# Altium project Double-Width Hub Bridge.PrjPcb
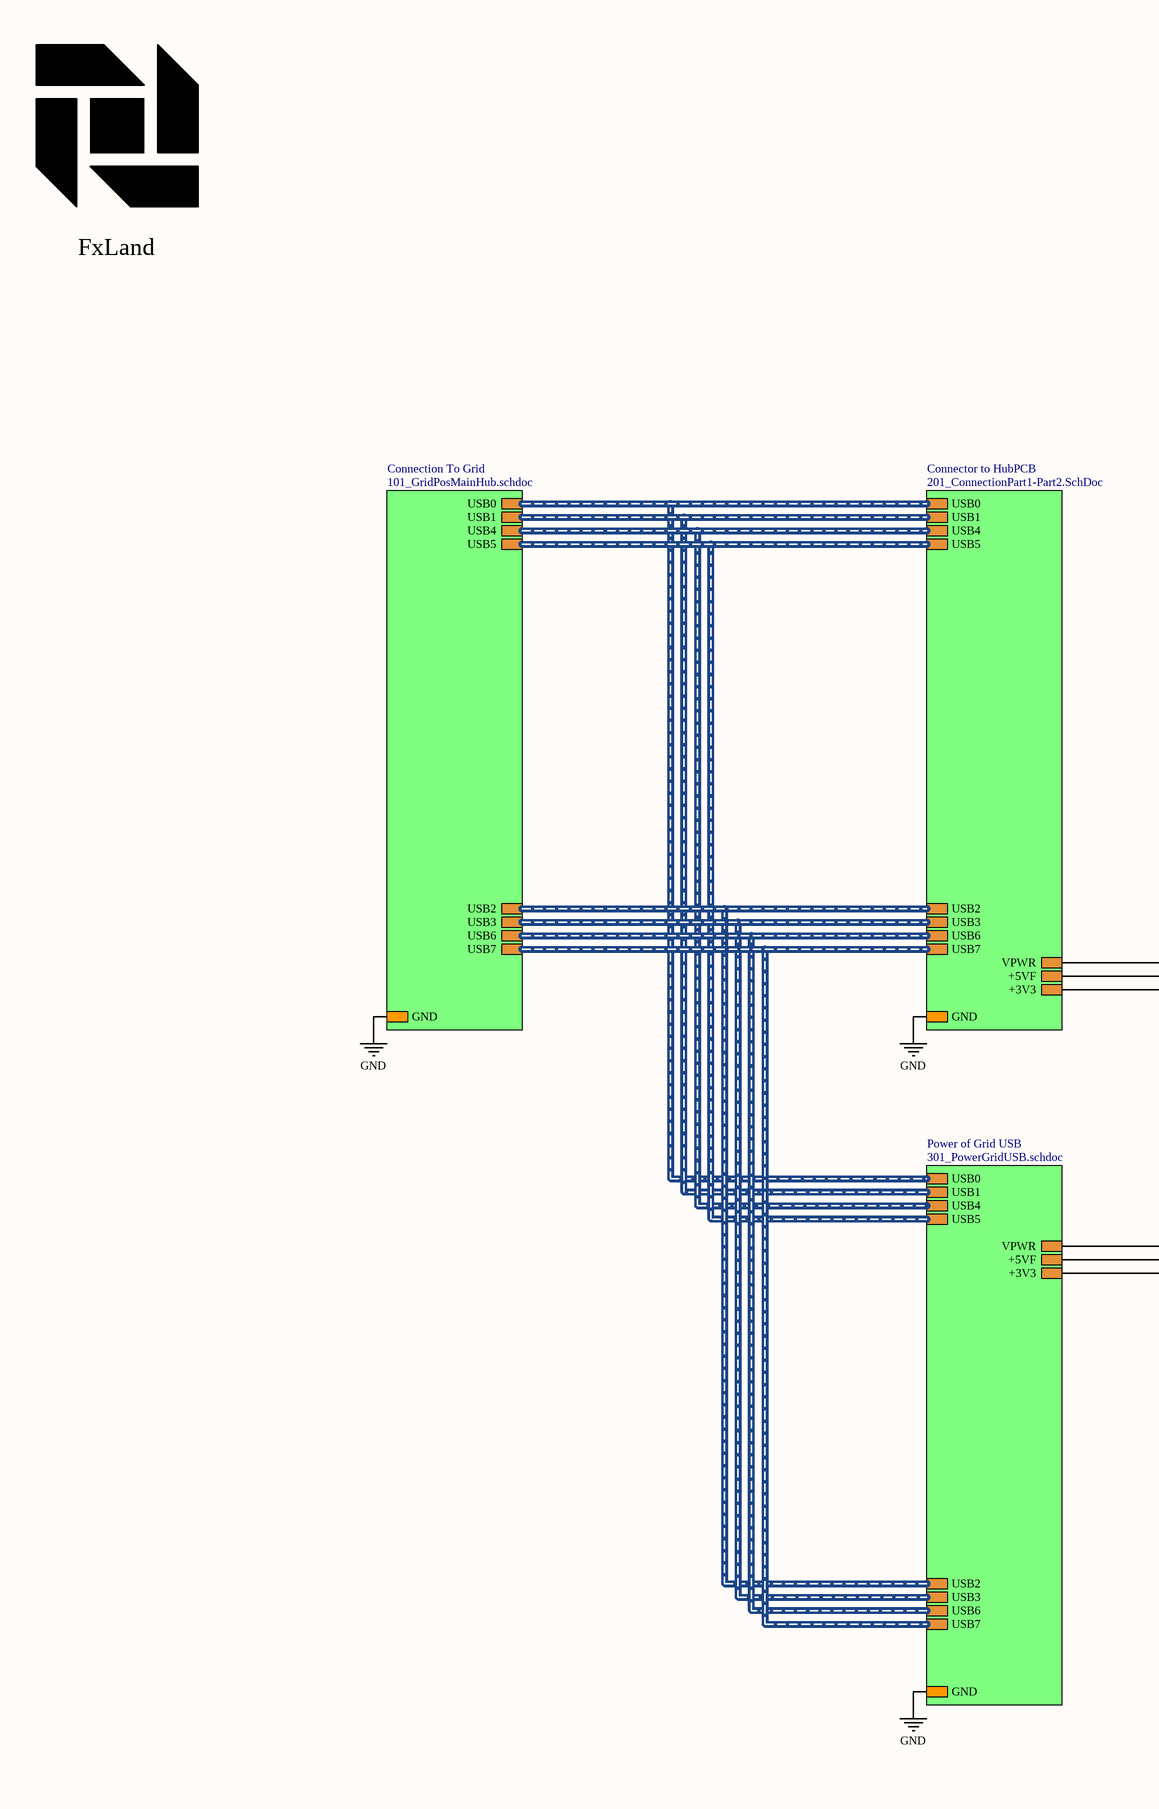
[diagram p0: 001_top.SchDoc, left]
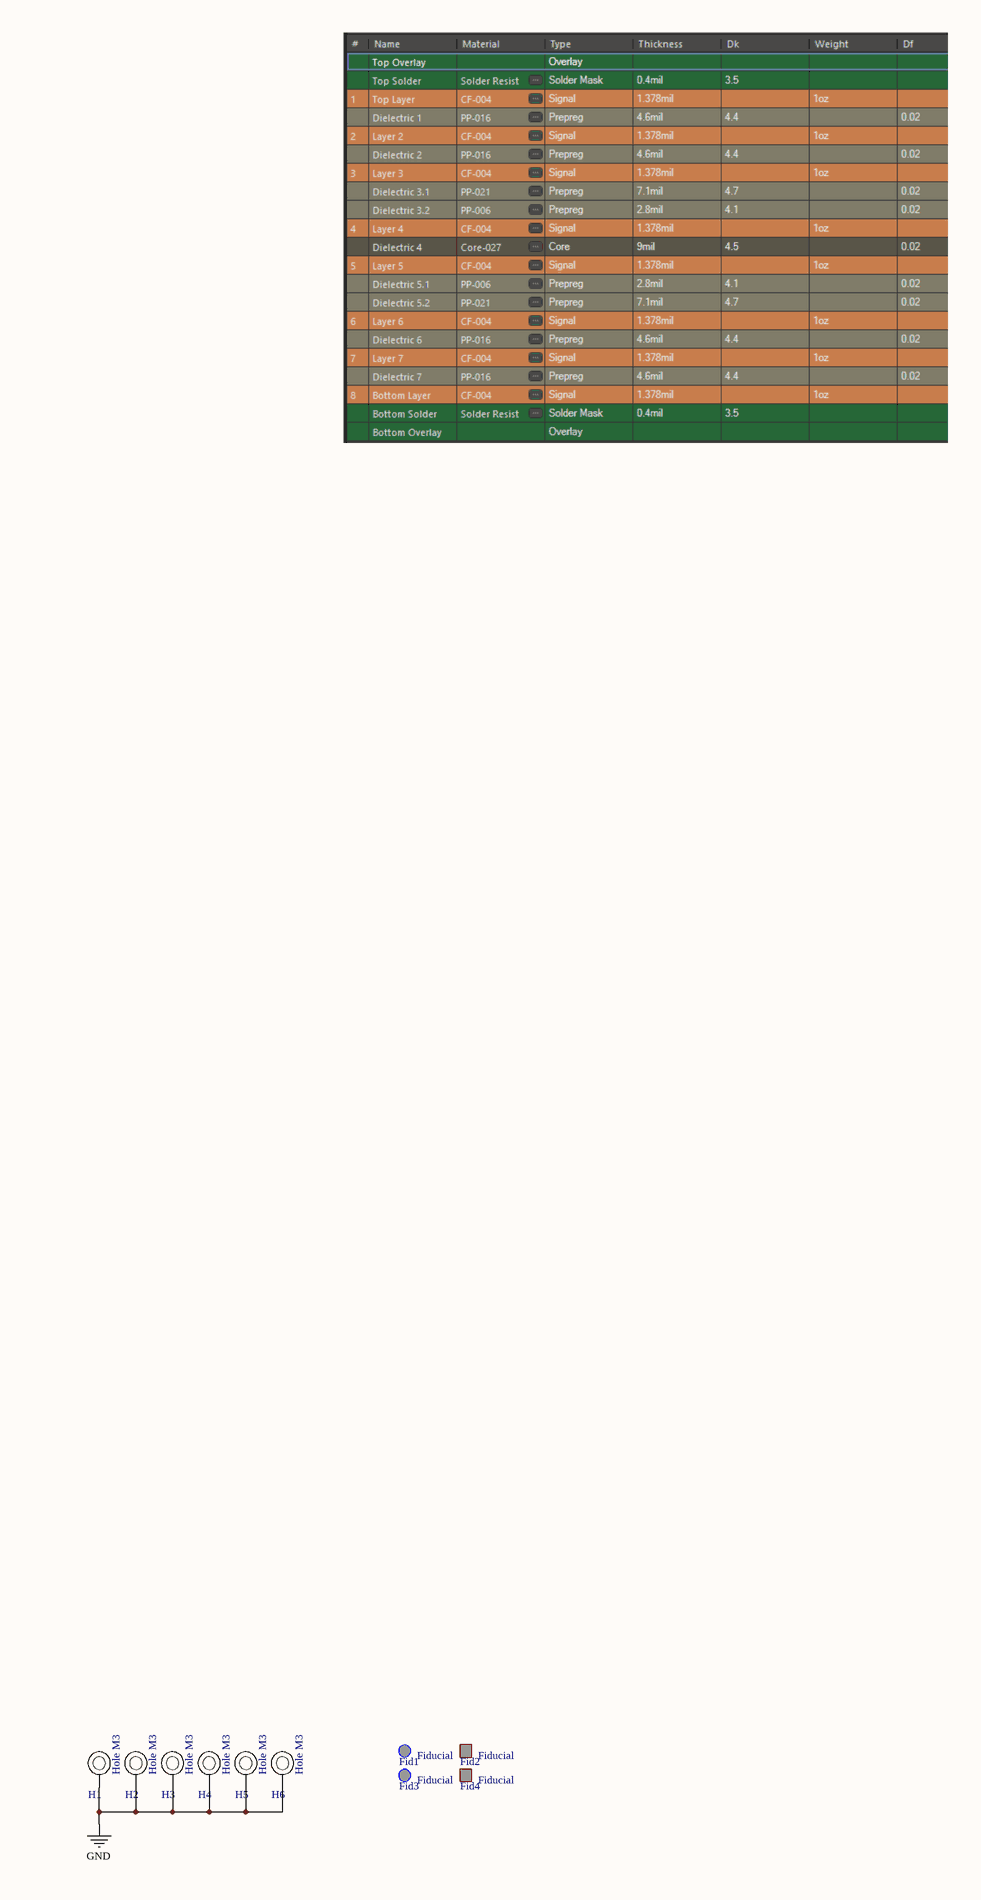
[diagram p1: 001_top.SchDoc, right]
DocNumber: P234; PrName: MainHub Part 1; Rev: 0.6
4 sheets, 132 parts. Net scope: hierarchical (ports join the sheet entries above them; power ports are global).
Board file: Double-Width Hub Bridge.PcbDoc
Sheets:
  001_top.SchDoc
    Connection To Grid = 101_GridPosMainHub.SchDoc
    Connector to HubPCB = 201_ConnectionPart1-Part2.SchDoc
    Power of Grid USB = 301_PowerGridUSB.SchDoc

## Sheet 001_top.SchDoc: Overview BAS Main Hub
size A2; Organization: Greenfield Tech Solutions; Address1: Molendreef 33; Address2: Ossendrecht; Address3: 4641CS; Address4: The Netherlands; DocumentNumber: P234; Revision: 0.6; SheetNumber: 1; SheetTotal: 4

### Parts
Fid1  Fiducial  [FidR_1.0mm]
Fid2  Fiducial  [FidS_1.0mm]
Fid3  Fiducial  [FidR_1.0mm]
Fid4  Fiducial  [FidS_1.0mm]
H1  Hole M3  [HOLE_M3]
H2  Hole M3  [HOLE_M3]
H3  Hole M3  [HOLE_M3]
H4  Hole M3  [HOLE_M3]
H5  Hole M3  [HOLE_M3]
H6  Hole M3  [HOLE_M3]
Logo_FxLand1  FxLand  [Logo_FxLand_3]  (value not drawn)

### Sub-sheets
Connection To Grid = 101_GridPosMainHub.schdoc: GND, USB0, USB1, USB4, USB5, USB2, USB3, USB6, USB7
Connector to HubPCB = 201_ConnectionPart1-Part2.SchDoc: GND, USB0, USB1, USB4, USB5, USB2, USB3, USB6, USB7, VPWR, +5VF, +3V3
Power of Grid USB = 301_PowerGridUSB.schdoc: GND, USB0, USB1, USB4, USB5, USB2, USB3, USB6, USB7, VPWR, +5VF, +3V3

### Nets
+3V3: sheet Connector to HubPCB/+3V3, sheet Power of Grid USB/+3V3
+5VF: sheet Connector to HubPCB/+5VF, sheet Power of Grid USB/+5VF
GND: H1.1 H2.1 H3.1 H4.1 H5.1 H6.1 ; sheet Connection To Grid/GND, sheet Connector to HubPCB/GND, sheet Power of Grid USB/GND
VPWR: sheet Connector to HubPCB/VPWR, sheet Power of Grid USB/VPWR

### Buses and harness runs
harness sheet Connection To Grid/USB0 = sheet Connector to HubPCB/USB0 = sheet Power of Grid USB/USB0
harness sheet Connection To Grid/USB1 = sheet Connector to HubPCB/USB1 = sheet Power of Grid USB/USB1
harness sheet Connection To Grid/USB2 = sheet Connector to HubPCB/USB2 = sheet Power of Grid USB/USB2
harness sheet Connection To Grid/USB3 = sheet Connector to HubPCB/USB3 = sheet Power of Grid USB/USB3
harness sheet Connection To Grid/USB4 = sheet Connector to HubPCB/USB4 = sheet Power of Grid USB/USB4
harness sheet Connection To Grid/USB5 = sheet Connector to HubPCB/USB5 = sheet Power of Grid USB/USB5
harness sheet Connection To Grid/USB6 = sheet Connector to HubPCB/USB6 = sheet Power of Grid USB/USB6
harness sheet Connection To Grid/USB7 = sheet Connector to HubPCB/USB7 = sheet Power of Grid USB/USB7

### Notes on the sheet
- Title
- Size:
- Date:
- File:
- A2
- Number:
- Time:
- Revision:
- Sheet
- of

### Library data of the parts
Fid1 Fid3 = ME0011: Fiducial Round 1mm; Part Number: ME0011; ID: 11; RefVal: Fiducial
Fid2 Fid4 = ME0012: Fiducial Sqaure 1mm; Part Number: ME0012; ID: 12; RefVal: Fiducial
H1-H6 = ME0001: Mounting Hole M3; Part Number: ME0001; ID: 1; RefVal: Hole M3
Logo_FxLand1 = ME0008: Logo FxLand 3; Part Number: ME0008; ID: 8; RefVal: FxLand

## Sheet 101_GridPosMainHub.SchDoc: Grid Position Main Hub
size A2; Organization: Greenfield Tech Solutions; Address1: Molendreef 33; Address2: Ossendrecht; Address3: 4641CS; Address4: The Netherlands; DocumentNumber: P234; Revision: 0.6; SheetNumber: 2; SheetTotal: 4
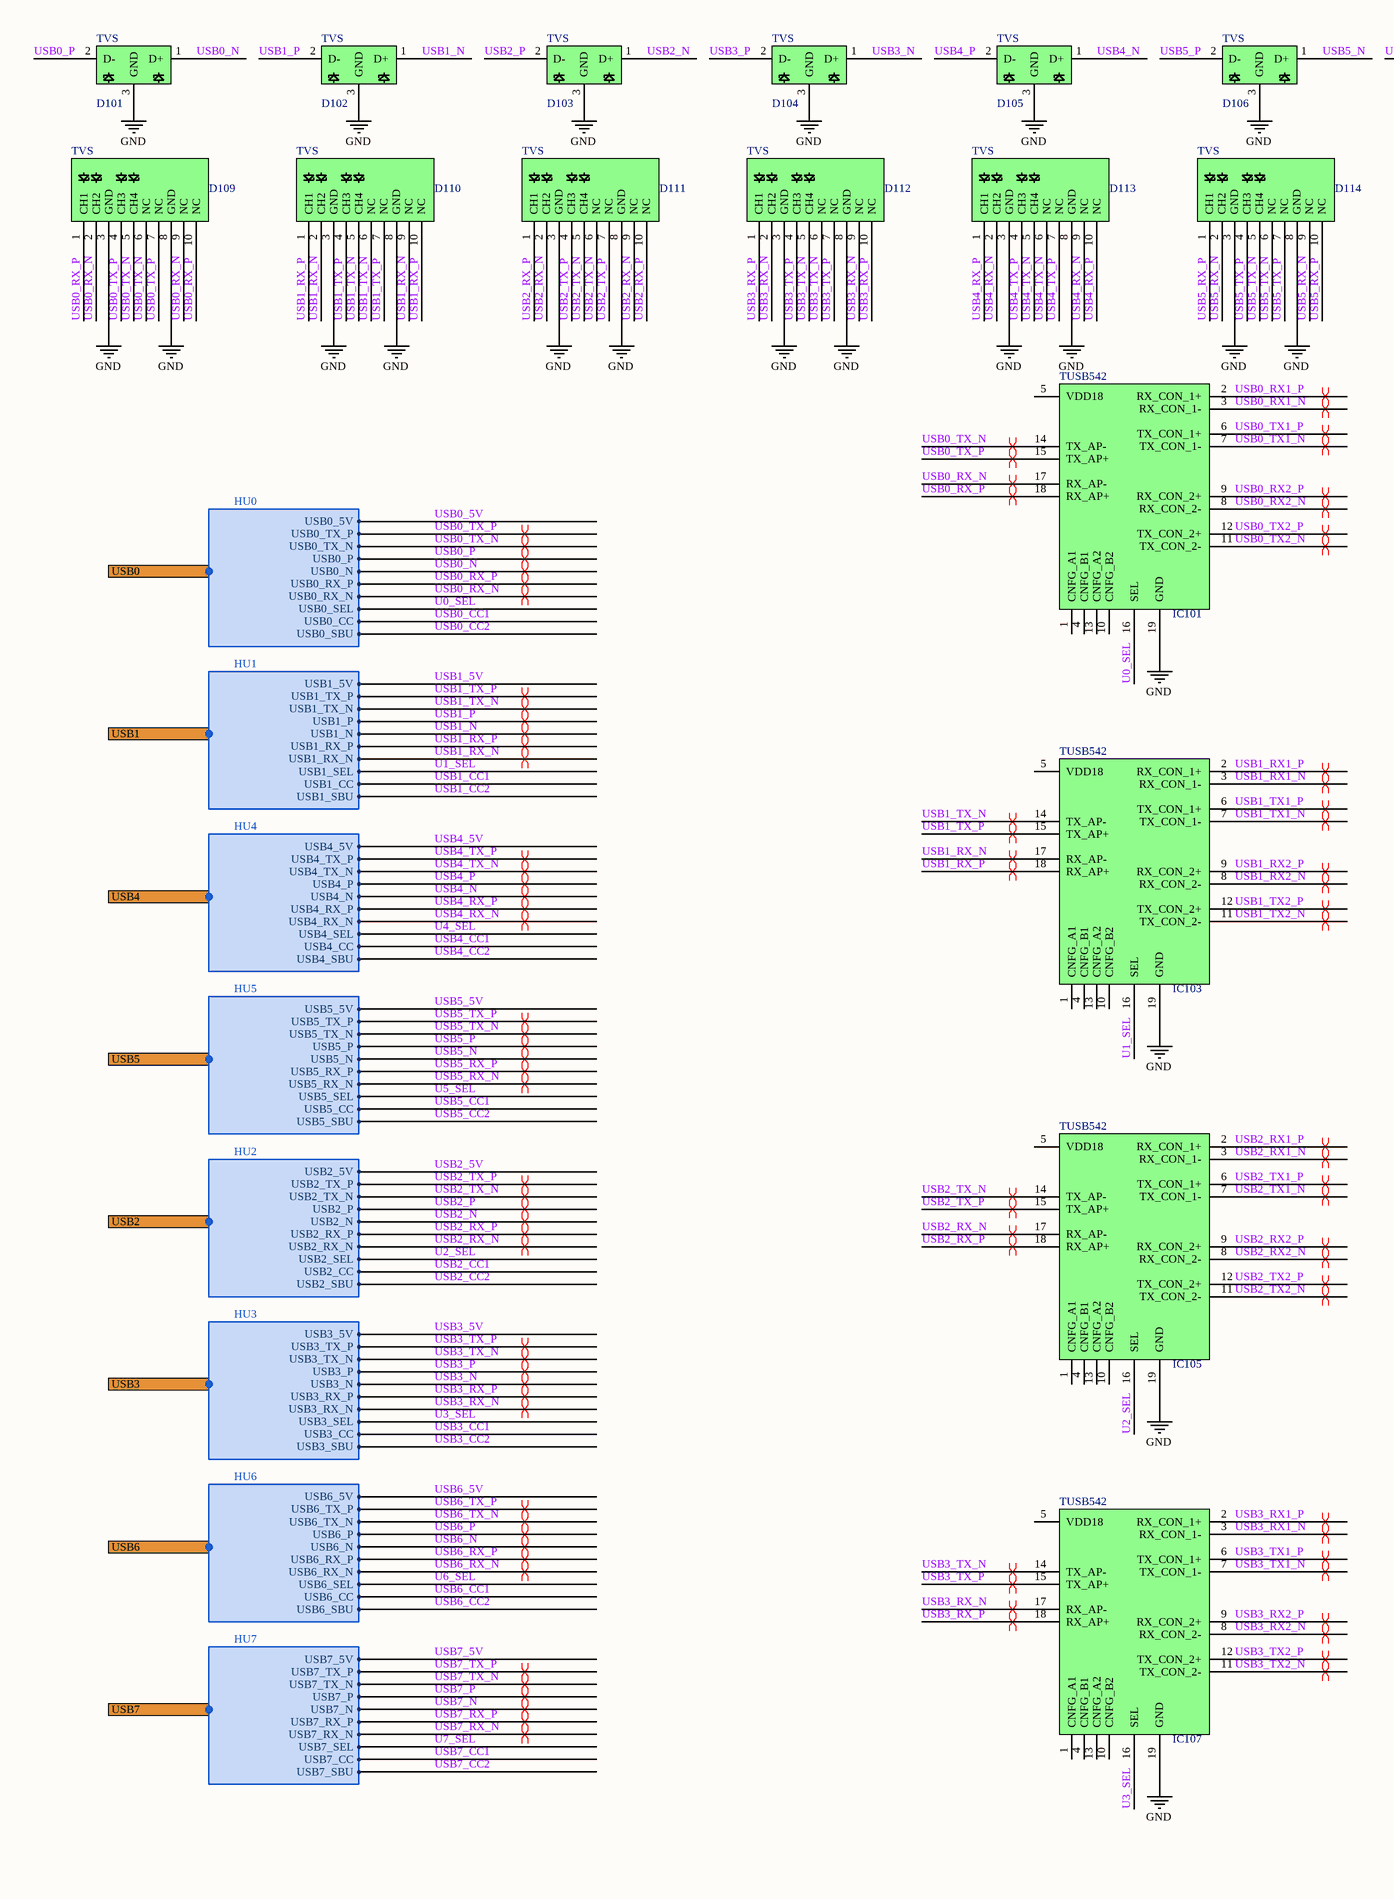
[diagram p2: 101_GridPosMainHub.SchDoc, left]
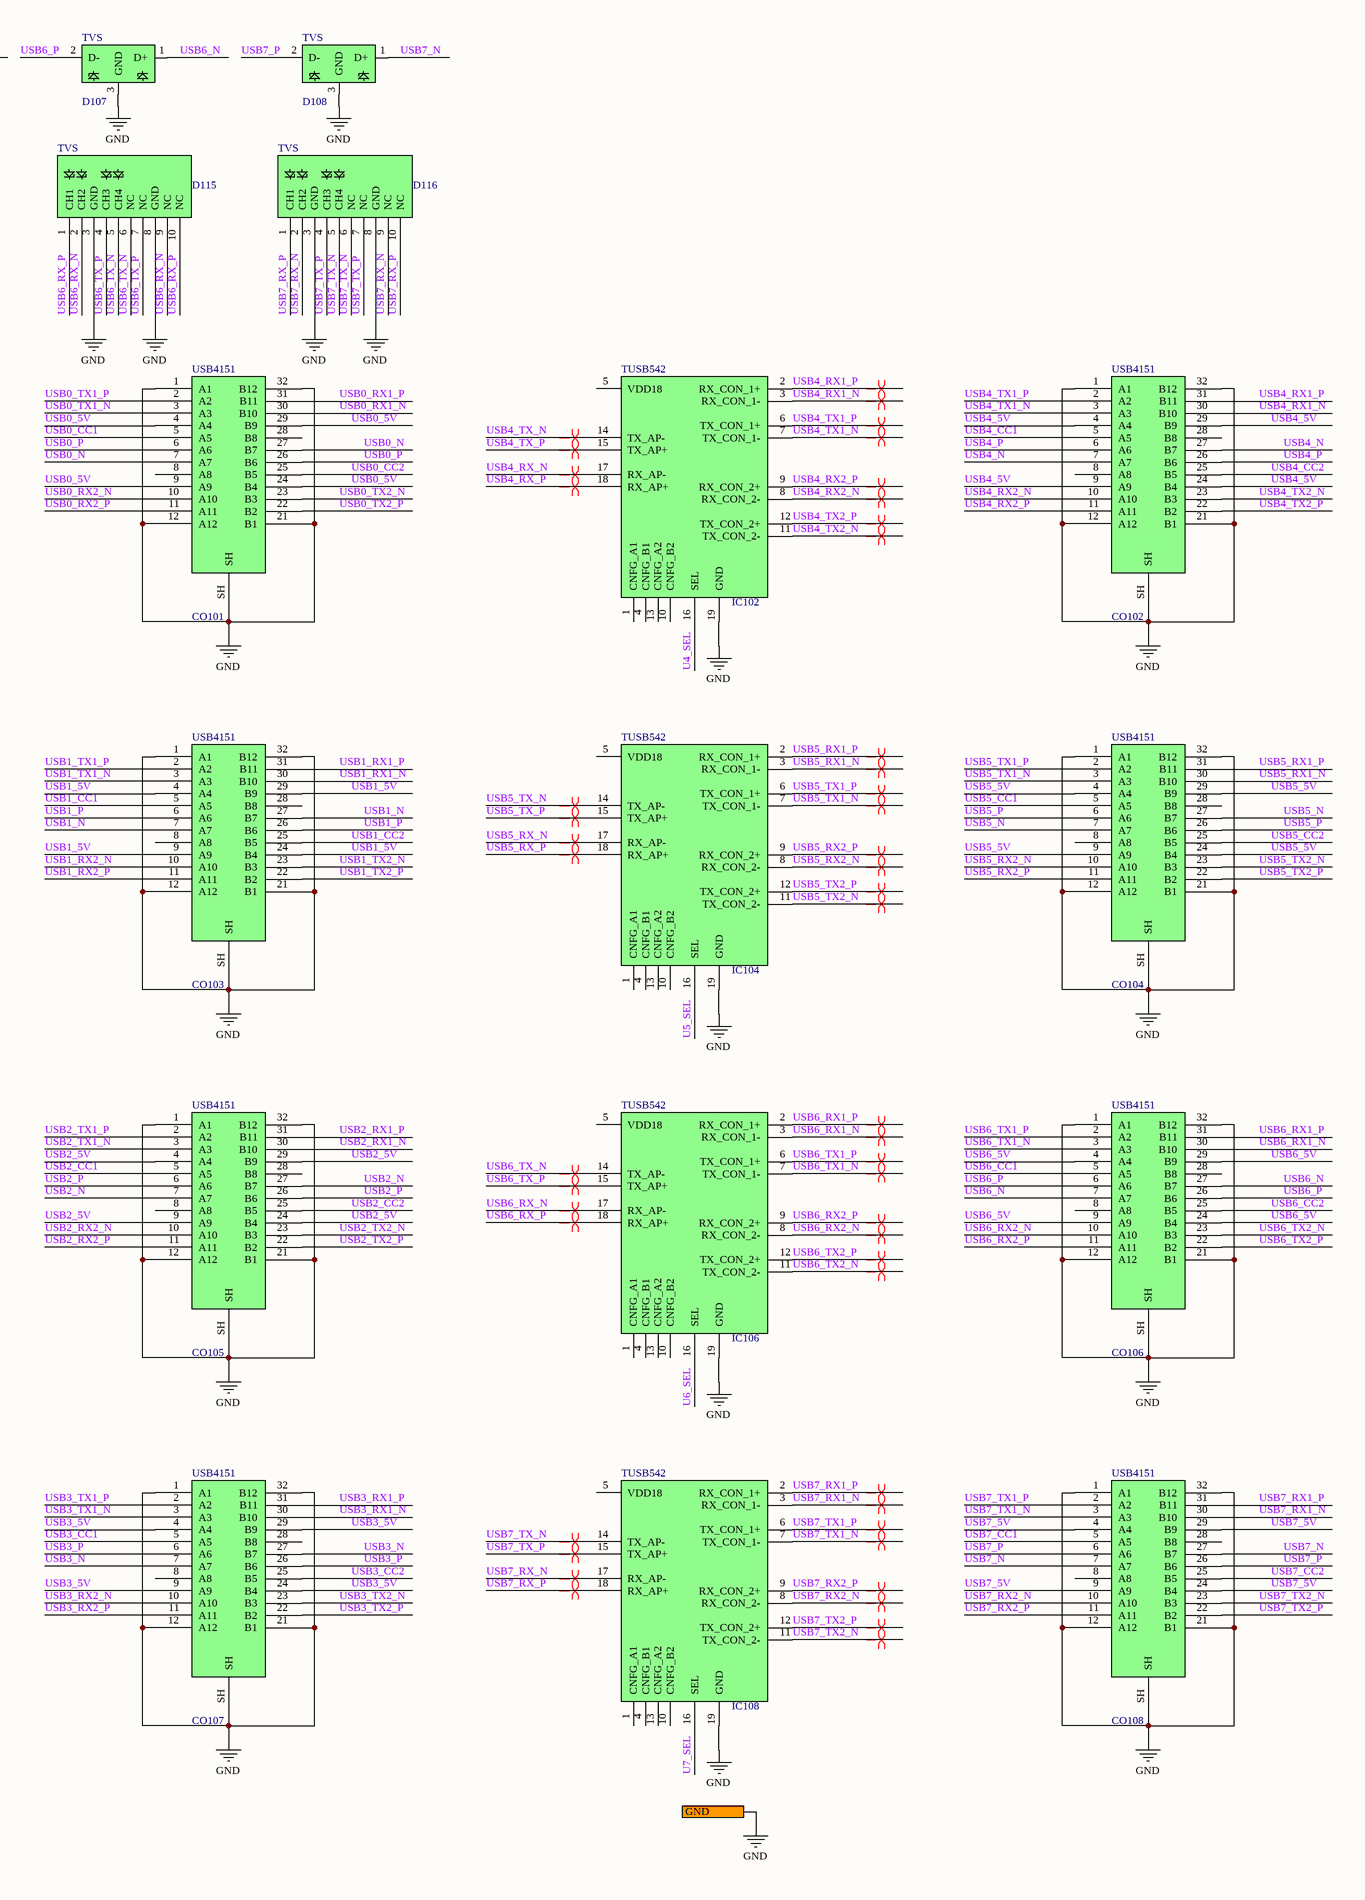
[diagram p3: 101_GridPosMainHub.SchDoc, right]

### Parts
CO101  USB4151  [USB4151-GF-C]
CO102  USB4151  [USB4151-GF-C]
CO103  USB4151  [USB4151-GF-C]
CO104  USB4151  [USB4151-GF-C]
CO105  USB4151  [USB4151-GF-C]
CO106  USB4151  [USB4151-GF-C]
CO107  USB4151  [USB4151-GF-C]
CO108  USB4151  [USB4151-GF-C]
D101  TVS  [SOT-3]
D102  TVS  [SOT-3]
D103  TVS  [SOT-3]
D104  TVS  [SOT-3]
D105  TVS  [SOT-3]
D106  TVS  [SOT-3]
D107  TVS  [SOT-3]
D108  TVS  [SOT-3]
D109  TVS  [SOT-1176-1]
D110  TVS  [SOT-1176-1]
D111  TVS  [SOT-1176-1]
D112  TVS  [SOT-1176-1]
D113  TVS  [SOT-1176-1]
D114  TVS  [SOT-1176-1]
D115  TVS  [SOT-1176-1]
D116  TVS  [SOT-1176-1]
IC101  TUSB542  [X2QFN-18]
IC102  TUSB542  [X2QFN-18]
IC103  TUSB542  [X2QFN-18]
IC104  TUSB542  [X2QFN-18]
IC105  TUSB542  [X2QFN-18]
IC106  TUSB542  [X2QFN-18]
IC107  TUSB542  [X2QFN-18]
IC108  TUSB542  [X2QFN-18]

### Ports
GND, USB0 (harness HU0), USB1 (harness HU1), USB2 (harness HU2), USB3 (harness HU3), USB4 (harness HU4), USB5 (harness HU5), USB6 (harness HU6), USB7 (harness HU7)

### Harnesses
HU0: USB0_5V, USB0_TX_P, USB0_TX_N, USB0_N, USB0_RX_P, USB0_RX_N, USB0_SEL, USB0_P, USB0_CC, USB0_SBU
HU5: USB5_5V, USB5_TX_P, USB5_TX_N, USB5_N, USB5_RX_P, USB5_RX_N, USB5_SEL, USB5_P, USB5_CC, USB5_SBU
HU4: USB4_5V, USB4_TX_P, USB4_TX_N, USB4_N, USB4_RX_P, USB4_RX_N, USB4_SEL, USB4_P, USB4_CC, USB4_SBU
HU1: USB1_5V, USB1_TX_P, USB1_TX_N, USB1_N, USB1_RX_P, USB1_RX_N, USB1_SEL, USB1_P, USB1_CC, USB1_SBU
HU7: USB7_5V, USB7_TX_P, USB7_TX_N, USB7_N, USB7_RX_P, USB7_RX_N, USB7_SEL, USB7_P, USB7_CC, USB7_SBU
HU6: USB6_5V, USB6_TX_P, USB6_TX_N, USB6_N, USB6_RX_P, USB6_RX_N, USB6_SEL, USB6_P, USB6_CC, USB6_SBU
HU3: USB3_5V, USB3_TX_P, USB3_TX_N, USB3_N, USB3_RX_P, USB3_RX_N, USB3_SEL, USB3_P, USB3_CC, USB3_SBU
HU2: USB2_5V, USB2_TX_P, USB2_TX_N, USB2_N, USB2_RX_P, USB2_RX_N, USB2_SEL, USB2_P, USB2_CC, USB2_SBU

### Nets
GND: CO101.1(A1) CO101.12(A12) CO101.21(B1) CO101.32(B12) CO101.SH CO102.1(A1) CO102.12(A12) CO102.21(B1) CO102.32(B12) CO102.SH CO103.1(A1) CO103.12(A12) CO103.21(B1) CO103.32(B12) CO103.SH CO104.1(A1) CO104.12(A12) CO104.21(B1) CO104.32(B12) CO104.SH CO105.1(A1) CO105.12(A12) CO105.21(B1) CO105.32(B12) CO105.SH CO106.1(A1) CO106.12(A12) CO106.21(B1) CO106.32(B12) CO106.SH CO107.1(A1) CO107.12(A12) CO107.21(B1) CO107.32(B12) CO107.SH CO108.1(A1) CO108.12(A12) CO108.21(B1) CO108.32(B12) CO108.SH D101.3(GND) D102.3(GND) D103.3(GND) D104.3(GND) D105.3(GND) D106.3(GND) D107.3(GND) D108.3(GND) D109.3(GND) D109.8(GND) D110.3(GND) D110.8(GND) D111.3(GND) D111.8(GND) D112.3(GND) D112.8(GND) D113.3(GND) D113.8(GND) D114.3(GND) D114.8(GND) D115.3(GND) D115.8(GND) D116.3(GND) D116.8(GND) IC101.19(GND) IC102.19(GND) IC103.19(GND) IC104.19(GND) IC105.19(GND) IC106.19(GND) IC107.19(GND) IC108.19(GND) ; port GND
U0_SEL: IC101.16(SEL) ; port USB0.USB0_SEL
U1_SEL: IC103.16(SEL) ; port USB1.USB1_SEL
U2_SEL: IC105.16(SEL) ; port USB2.USB2_SEL
U3_SEL: IC107.16(SEL) ; port USB3.USB3_SEL
U4_SEL: IC102.16(SEL) ; port USB4.USB4_SEL
U5_SEL: IC104.16(SEL) ; port USB5.USB5_SEL
U6_SEL: IC106.16(SEL) ; port USB6.USB6_SEL
U7_SEL: IC108.16(SEL) ; port USB7.USB7_SEL
USB0_5V: CO101.4(A4) CO101.9(A9) CO101.24(B4) CO101.29(B9) ; port USB0.USB0_5V
USB0_CC1: CO101.5(A5) ; port USB0.USB0_CC
USB0_CC2: CO101.25(B5) ; port USB0.USB0_SBU
USB0_N: CO101.7(A7) CO101.27(B7) D101.1(D+) ; port USB0.USB0_N
USB0_P: CO101.6(A6) CO101.26(B6) D101.2(D-) ; port USB0.USB0_P
USB0_RX1_N: CO101.30(B10) IC101.3(RX_CON_1-)
USB0_RX1_P: CO101.31(B11) IC101.2(RX_CON_1+)
USB0_RX2_N: CO101.10(A10) IC101.8(RX_CON_2-)
USB0_RX2_P: CO101.11(A11) IC101.9(RX_CON_2+)
USB0_RX_N: D109.2(CH2) D109.9(NC) IC101.17(RX_AP-) ; port USB0.USB0_RX_N
USB0_RX_P: D109.1(CH1) D109.10(NC) IC101.18(RX_AP+) ; port USB0.USB0_RX_P
USB0_TX1_N: CO101.3(A3) IC101.7(TX_CON_1-)
USB0_TX1_P: CO101.2(A2) IC101.6(TX_CON_1+)
USB0_TX2_N: CO101.23(B3) IC101.11(TX_CON_2-)
USB0_TX2_P: CO101.22(B2) IC101.12(TX_CON_2+)
USB0_TX_N: D109.5(CH4) D109.6(NC) IC101.14(TX_AP-) ; port USB0.USB0_TX_N
USB0_TX_P: D109.4(CH3) D109.7(NC) IC101.15(TX_AP+) ; port USB0.USB0_TX_P
USB1_5V: CO103.4(A4) CO103.9(A9) CO103.24(B4) CO103.29(B9) ; port USB1.USB1_5V
USB1_CC1: CO103.5(A5) ; port USB1.USB1_CC
USB1_CC2: CO103.25(B5) ; port USB1.USB1_SBU
USB1_N: CO103.7(A7) CO103.27(B7) D102.1(D+) ; port USB1.USB1_N
USB1_P: CO103.6(A6) CO103.26(B6) D102.2(D-) ; port USB1.USB1_P
USB1_RX1_N: CO103.30(B10) IC103.3(RX_CON_1-)
USB1_RX1_P: CO103.31(B11) IC103.2(RX_CON_1+)
USB1_RX2_N: CO103.10(A10) IC103.8(RX_CON_2-)
USB1_RX2_P: CO103.11(A11) IC103.9(RX_CON_2+)
USB1_RX_N: D110.2(CH2) D110.9(NC) IC103.17(RX_AP-) ; port USB1.USB1_RX_N
USB1_RX_P: D110.1(CH1) D110.10(NC) IC103.18(RX_AP+) ; port USB1.USB1_RX_P
USB1_TX1_N: CO103.3(A3) IC103.7(TX_CON_1-)
USB1_TX1_P: CO103.2(A2) IC103.6(TX_CON_1+)
USB1_TX2_N: CO103.23(B3) IC103.11(TX_CON_2-)
USB1_TX2_P: CO103.22(B2) IC103.12(TX_CON_2+)
USB1_TX_N: D110.5(CH4) D110.6(NC) IC103.14(TX_AP-) ; port USB1.USB1_TX_N
USB1_TX_P: D110.4(CH3) D110.7(NC) IC103.15(TX_AP+) ; port USB1.USB1_TX_P
USB2_5V: CO105.4(A4) CO105.9(A9) CO105.24(B4) CO105.29(B9) ; port USB2.USB2_5V
USB2_CC1: CO105.5(A5) ; port USB2.USB2_CC
USB2_CC2: CO105.25(B5) ; port USB2.USB2_SBU
USB2_N: CO105.7(A7) CO105.27(B7) D103.1(D+) ; port USB2.USB2_N
USB2_P: CO105.6(A6) CO105.26(B6) D103.2(D-) ; port USB2.USB2_P
USB2_RX1_N: CO105.30(B10) IC105.3(RX_CON_1-)
USB2_RX1_P: CO105.31(B11) IC105.2(RX_CON_1+)
USB2_RX2_N: CO105.10(A10) IC105.8(RX_CON_2-)
USB2_RX2_P: CO105.11(A11) IC105.9(RX_CON_2+)
USB2_RX_N: D111.2(CH2) D111.9(NC) IC105.17(RX_AP-) ; port USB2.USB2_RX_N
USB2_RX_P: D111.1(CH1) D111.10(NC) IC105.18(RX_AP+) ; port USB2.USB2_RX_P
USB2_TX1_N: CO105.3(A3) IC105.7(TX_CON_1-)
USB2_TX1_P: CO105.2(A2) IC105.6(TX_CON_1+)
USB2_TX2_N: CO105.23(B3) IC105.11(TX_CON_2-)
USB2_TX2_P: CO105.22(B2) IC105.12(TX_CON_2+)
USB2_TX_N: D111.5(CH4) D111.6(NC) IC105.14(TX_AP-) ; port USB2.USB2_TX_N
USB2_TX_P: D111.4(CH3) D111.7(NC) IC105.15(TX_AP+) ; port USB2.USB2_TX_P
USB3_5V: CO107.4(A4) CO107.9(A9) CO107.24(B4) CO107.29(B9) ; port USB3.USB3_5V
USB3_CC1: CO107.5(A5) ; port USB3.USB3_CC
USB3_CC2: CO107.25(B5) ; port USB3.USB3_SBU
USB3_N: CO107.7(A7) CO107.27(B7) D104.1(D+) ; port USB3.USB3_N
USB3_P: CO107.6(A6) CO107.26(B6) D104.2(D-) ; port USB3.USB3_P
USB3_RX1_N: CO107.30(B10) IC107.3(RX_CON_1-)
USB3_RX1_P: CO107.31(B11) IC107.2(RX_CON_1+)
USB3_RX2_N: CO107.10(A10) IC107.8(RX_CON_2-)
USB3_RX2_P: CO107.11(A11) IC107.9(RX_CON_2+)
USB3_RX_N: D112.2(CH2) D112.9(NC) IC107.17(RX_AP-) ; port USB3.USB3_RX_N
USB3_RX_P: D112.1(CH1) D112.10(NC) IC107.18(RX_AP+) ; port USB3.USB3_RX_P
USB3_TX1_N: CO107.3(A3) IC107.7(TX_CON_1-)
USB3_TX1_P: CO107.2(A2) IC107.6(TX_CON_1+)
USB3_TX2_N: CO107.23(B3) IC107.11(TX_CON_2-)
USB3_TX2_P: CO107.22(B2) IC107.12(TX_CON_2+)
USB3_TX_N: D112.5(CH4) D112.6(NC) IC107.14(TX_AP-) ; port USB3.USB3_TX_N
USB3_TX_P: D112.4(CH3) D112.7(NC) IC107.15(TX_AP+) ; port USB3.USB3_TX_P
USB4_5V: CO102.4(A4) CO102.9(A9) CO102.24(B4) CO102.29(B9) ; port USB4.USB4_5V
USB4_CC1: CO102.5(A5) ; port USB4.USB4_CC
USB4_CC2: CO102.25(B5) ; port USB4.USB4_SBU
USB4_N: CO102.7(A7) CO102.27(B7) D105.1(D+) ; port USB4.USB4_N
USB4_P: CO102.6(A6) CO102.26(B6) D105.2(D-) ; port USB4.USB4_P
USB4_RX1_N: CO102.30(B10) IC102.3(RX_CON_1-)
USB4_RX1_P: CO102.31(B11) IC102.2(RX_CON_1+)
USB4_RX2_N: CO102.10(A10) IC102.8(RX_CON_2-)
USB4_RX2_P: CO102.11(A11) IC102.9(RX_CON_2+)
USB4_RX_N: D113.2(CH2) D113.9(NC) IC102.17(RX_AP-) ; port USB4.USB4_RX_N
USB4_RX_P: D113.1(CH1) D113.10(NC) IC102.18(RX_AP+) ; port USB4.USB4_RX_P
USB4_TX1_N: CO102.3(A3) IC102.7(TX_CON_1-)
USB4_TX1_P: CO102.2(A2) IC102.6(TX_CON_1+)
USB4_TX2_N: CO102.23(B3) IC102.11(TX_CON_2-)
USB4_TX2_P: CO102.22(B2) IC102.12(TX_CON_2+)
USB4_TX_N: D113.5(CH4) D113.6(NC) IC102.14(TX_AP-) ; port USB4.USB4_TX_N
USB4_TX_P: D113.4(CH3) D113.7(NC) IC102.15(TX_AP+) ; port USB4.USB4_TX_P
USB5_5V: CO104.4(A4) CO104.9(A9) CO104.24(B4) CO104.29(B9) ; port USB5.USB5_5V
USB5_CC1: CO104.5(A5) ; port USB5.USB5_CC
USB5_CC2: CO104.25(B5) ; port USB5.USB5_SBU
USB5_N: CO104.7(A7) CO104.27(B7) D106.1(D+) ; port USB5.USB5_N
USB5_P: CO104.6(A6) CO104.26(B6) D106.2(D-) ; port USB5.USB5_P
USB5_RX1_N: CO104.30(B10) IC104.3(RX_CON_1-)
USB5_RX1_P: CO104.31(B11) IC104.2(RX_CON_1+)
USB5_RX2_N: CO104.10(A10) IC104.8(RX_CON_2-)
USB5_RX2_P: CO104.11(A11) IC104.9(RX_CON_2+)
USB5_RX_N: D114.2(CH2) D114.9(NC) IC104.17(RX_AP-) ; port USB5.USB5_RX_N
USB5_RX_P: D114.1(CH1) D114.10(NC) IC104.18(RX_AP+) ; port USB5.USB5_RX_P
USB5_TX1_N: CO104.3(A3) IC104.7(TX_CON_1-)
USB5_TX1_P: CO104.2(A2) IC104.6(TX_CON_1+)
USB5_TX2_N: CO104.23(B3) IC104.11(TX_CON_2-)
USB5_TX2_P: CO104.22(B2) IC104.12(TX_CON_2+)
USB5_TX_N: D114.5(CH4) D114.6(NC) IC104.14(TX_AP-) ; port USB5.USB5_TX_N
USB5_TX_P: D114.4(CH3) D114.7(NC) IC104.15(TX_AP+) ; port USB5.USB5_TX_P
USB6_5V: CO106.4(A4) CO106.9(A9) CO106.24(B4) CO106.29(B9) ; port USB6.USB6_5V
USB6_CC1: CO106.5(A5) ; port USB6.USB6_CC
USB6_CC2: CO106.25(B5) ; port USB6.USB6_SBU
USB6_N: CO106.7(A7) CO106.27(B7) D107.1(D+) ; port USB6.USB6_N
USB6_P: CO106.6(A6) CO106.26(B6) D107.2(D-) ; port USB6.USB6_P
USB6_RX1_N: CO106.30(B10) IC106.3(RX_CON_1-)
USB6_RX1_P: CO106.31(B11) IC106.2(RX_CON_1+)
USB6_RX2_N: CO106.10(A10) IC106.8(RX_CON_2-)
USB6_RX2_P: CO106.11(A11) IC106.9(RX_CON_2+)
USB6_RX_N: D115.2(CH2) D115.9(NC) IC106.17(RX_AP-) ; port USB6.USB6_RX_N
USB6_RX_P: D115.1(CH1) D115.10(NC) IC106.18(RX_AP+) ; port USB6.USB6_RX_P
USB6_TX1_N: CO106.3(A3) IC106.7(TX_CON_1-)
USB6_TX1_P: CO106.2(A2) IC106.6(TX_CON_1+)
USB6_TX2_N: CO106.23(B3) IC106.11(TX_CON_2-)
USB6_TX2_P: CO106.22(B2) IC106.12(TX_CON_2+)
USB6_TX_N: D115.5(CH4) D115.6(NC) IC106.14(TX_AP-) ; port USB6.USB6_TX_N
USB6_TX_P: D115.4(CH3) D115.7(NC) IC106.15(TX_AP+) ; port USB6.USB6_TX_P
USB7_5V: CO108.4(A4) CO108.9(A9) CO108.24(B4) CO108.29(B9) ; port USB7.USB7_5V
USB7_CC1: CO108.5(A5) ; port USB7.USB7_CC
USB7_CC2: CO108.25(B5) ; port USB7.USB7_SBU
USB7_N: CO108.7(A7) CO108.27(B7) D108.1(D+) ; port USB7.USB7_N
USB7_P: CO108.6(A6) CO108.26(B6) D108.2(D-) ; port USB7.USB7_P
USB7_RX1_N: CO108.30(B10) IC108.3(RX_CON_1-)
USB7_RX1_P: CO108.31(B11) IC108.2(RX_CON_1+)
USB7_RX2_N: CO108.10(A10) IC108.8(RX_CON_2-)
USB7_RX2_P: CO108.11(A11) IC108.9(RX_CON_2+)
USB7_RX_N: D116.2(CH2) D116.9(NC) IC108.17(RX_AP-) ; port USB7.USB7_RX_N
USB7_RX_P: D116.1(CH1) D116.10(NC) IC108.18(RX_AP+) ; port USB7.USB7_RX_P
USB7_TX1_N: CO108.3(A3) IC108.7(TX_CON_1-)
USB7_TX1_P: CO108.2(A2) IC108.6(TX_CON_1+)
USB7_TX2_N: CO108.23(B3) IC108.11(TX_CON_2-)
USB7_TX2_P: CO108.22(B2) IC108.12(TX_CON_2+)
USB7_TX_N: D116.5(CH4) D116.6(NC) IC108.14(TX_AP-) ; port USB7.USB7_TX_N
USB7_TX_P: D116.4(CH3) D116.7(NC) IC108.15(TX_AP+) ; port USB7.USB7_TX_P

Not connected (* = marked no-connect by the designer): CO101 8(A8) 28(B8); CO102 8(A8) 28(B8); CO103 8(A8) 28(B8); CO104 8(A8) 28(B8); CO105 8(A8) 28(B8); CO106 8(A8) 28(B8); CO107 8(A8) 28(B8); CO108 8(A8) 28(B8); IC101 1(CNFG_A1) 4(CNFG_B1) 5(VDD18) 10(CNFG_B2) 13(CNFG_A2); IC102 1(CNFG_A1) 4(CNFG_B1) 5(VDD18) 10(CNFG_B2) 13(CNFG_A2); IC103 1(CNFG_A1) 4(CNFG_B1) 5(VDD18) 10(CNFG_B2) 13(CNFG_A2); IC104 1(CNFG_A1) 4(CNFG_B1) 5(VDD18) 10(CNFG_B2) 13(CNFG_A2); IC105 1(CNFG_A1) 4(CNFG_B1) 5(VDD18) 10(CNFG_B2) 13(CNFG_A2); IC106 1(CNFG_A1) 4(CNFG_B1) 5(VDD18) 10(CNFG_B2) 13(CNFG_A2); IC107 1(CNFG_A1) 4(CNFG_B1) 5(VDD18) 10(CNFG_B2) 13(CNFG_A2); IC108 1(CNFG_A1) 4(CNFG_B1) 5(VDD18) 10(CNFG_B2) 13(CNFG_A2)

### Layout directives
differential pair; differential pair class USB3: USB0_N, USB0_P, USB0_RX1_N, USB0_RX1_P, USB0_RX2_N, USB0_RX2_P, USB0_RX_N, USB0_RX_P, USB0_TX1_N, USB0_TX1_P, USB0_TX2_N, USB0_TX2_P, USB0_TX_N, USB0_TX_P, USB1_N, USB1_P, USB1_RX1_N, USB1_RX1_P, USB1_RX2_N, USB1_RX2_P, USB1_RX_N, USB1_RX_P, USB1_TX1_N, USB1_TX1_P, USB1_TX2_N, USB1_TX2_P, USB1_TX_N, USB1_TX_P, USB2_N, USB2_P, USB2_RX1_N, USB2_RX1_P, USB2_RX2_N, USB2_RX2_P, USB2_RX_N, USB2_RX_P, USB2_TX1_N, USB2_TX1_P, USB2_TX2_N, USB2_TX2_P, USB2_TX_N, USB2_TX_P, USB3_N, USB3_P, USB3_RX1_N, USB3_RX1_P, USB3_RX2_N, USB3_RX2_P, USB3_RX_N, USB3_RX_P, USB3_TX1_N, USB3_TX1_P, USB3_TX2_N, USB3_TX2_P, USB3_TX_N, USB3_TX_P, USB4_N, USB4_P, USB4_RX1_N, USB4_RX1_P, USB4_RX2_N, USB4_RX2_P, USB4_RX_N, USB4_RX_P, USB4_TX1_N, USB4_TX1_P, USB4_TX2_N, USB4_TX2_P, USB4_TX_N, USB4_TX_P, USB5_N, USB5_P, USB5_RX1_N, USB5_RX1_P, USB5_RX2_N, USB5_RX2_P, USB5_RX_N, USB5_RX_P, USB5_TX1_N, USB5_TX1_P, USB5_TX2_N, USB5_TX2_P, USB5_TX_N, USB5_TX_P, USB6_N, USB6_P, USB6_RX1_N, USB6_RX1_P, USB6_RX2_N, USB6_RX2_P, USB6_RX_N, USB6_RX_P, USB6_TX1_N, USB6_TX1_P, USB6_TX2_N, USB6_TX2_P, USB6_TX_N, USB6_TX_P, USB7_N, USB7_P, USB7_RX1_N, USB7_RX1_P, USB7_RX2_N, USB7_RX2_P, USB7_RX_N, USB7_RX_P, USB7_TX1_N, USB7_TX1_P, USB7_TX2_N, USB7_TX2_P, USB7_TX_N, USB7_TX_P

### Notes on the sheet
- Title
- Size:
- Date:
- File:
- A2
- Number:
- Time:
- Revision:
- Sheet
- of

### Library data of the parts
CO101-CO108 = CO0017: USB C connector Plug Vertical; Part Number: CO0017; ID: 26; RefVal: USB4151; ManfactPart: USB4151-GF-C
D101-D108 = DI0002: USB 2 TVS Diode; Part Number: DI0002; ManfactPart: TPD2EUSB30DRTR; ID: 2; RefVal: TVS
D109-D116 = DI0007: USB 3 TVS Diode; Part Number: DI0007; ManfactPart: PUSB3FA2Z; ID: 7; RefVal: TVS
IC101-IC108 = IC0039: TUSB542 USB Type-C 5 Gbps Redriver 2:1 MUX; Part Number: IC0039; ID: 39; RefVal: TUSB542; ManfactPart: TUSB542

## Sheet 201_ConnectionPart1-Part2.SchDoc: Connector to HubPCB
size A2; Organization: Greenfield Tech Solutions; Address1: Molendreef 33; Address2: Ossendrecht; Address3: 4641CS; Address4: The Netherlands; DocumentNumber: P234; Revision: 0.6; SheetNumber: 3; SheetTotal: 4
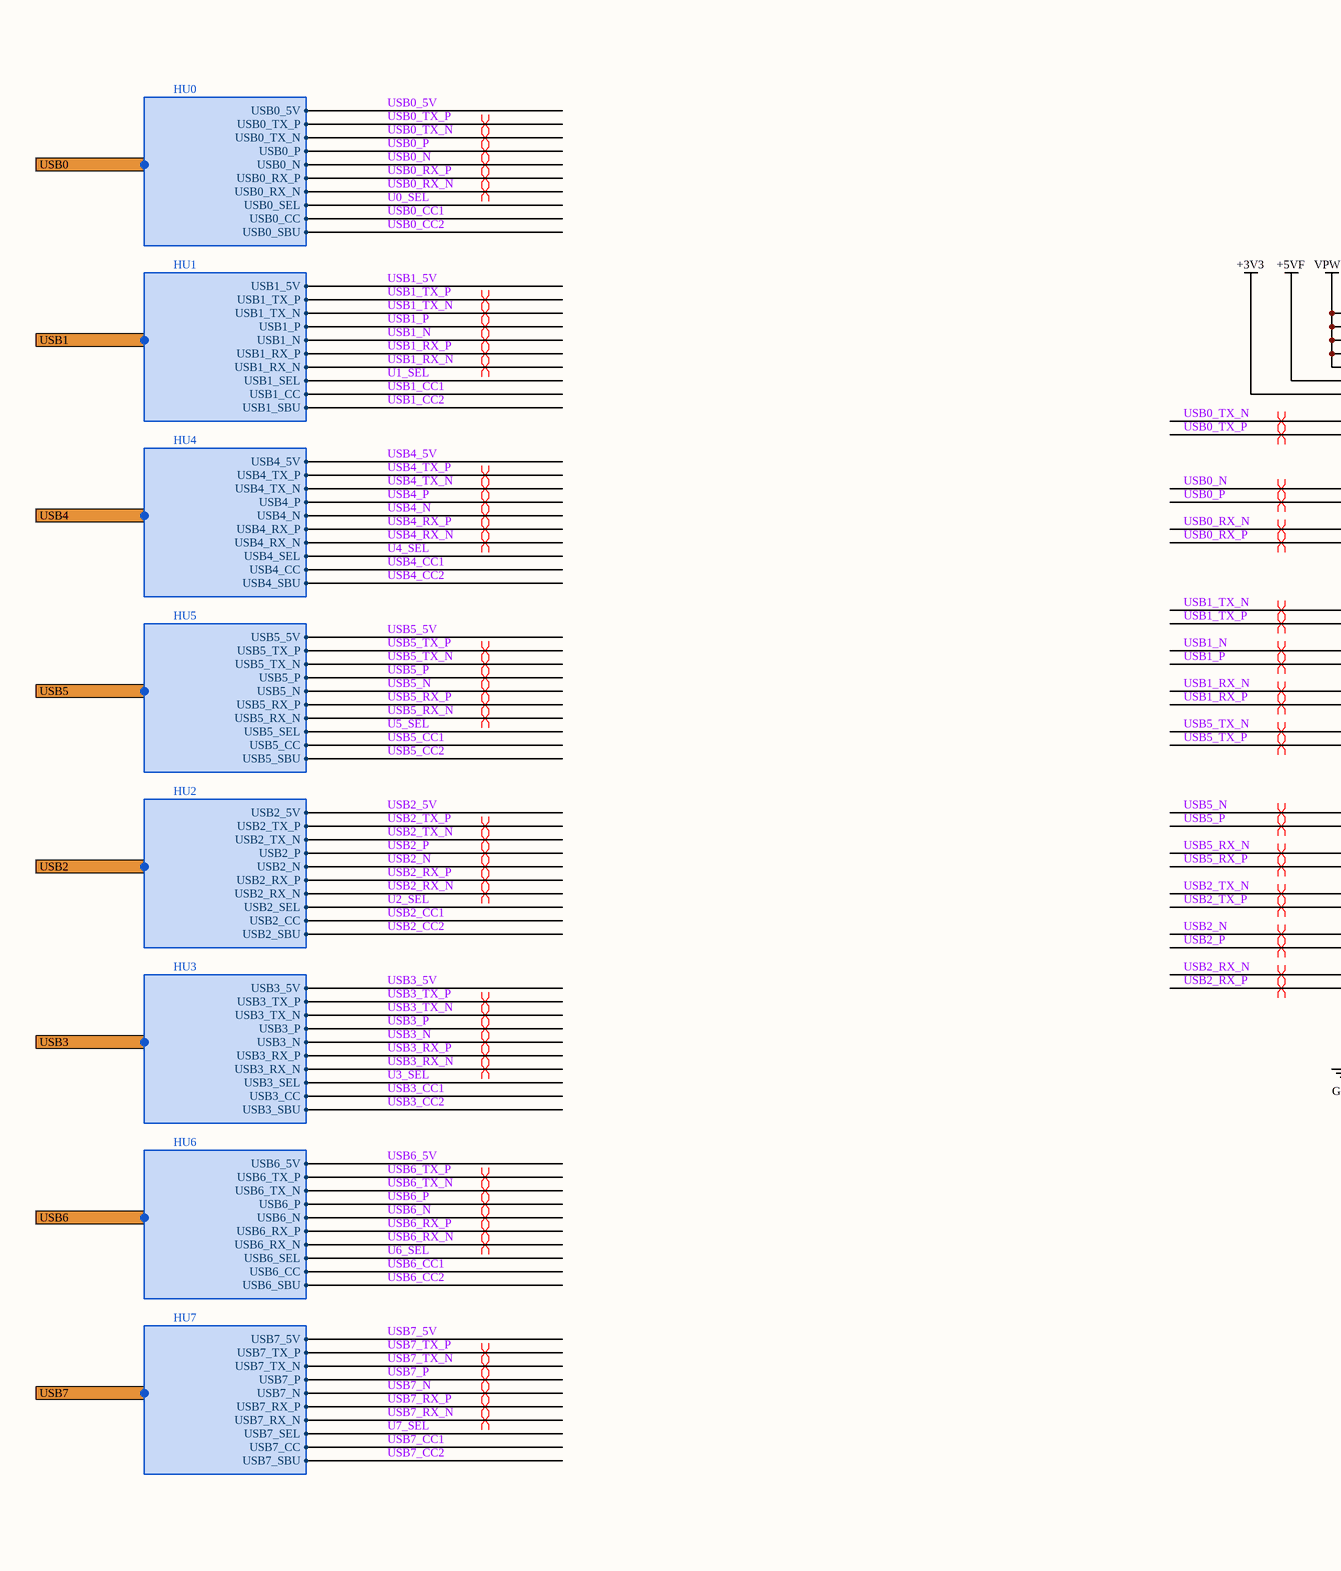
[diagram p4: 201_ConnectionPart1-Part2.SchDoc, left]
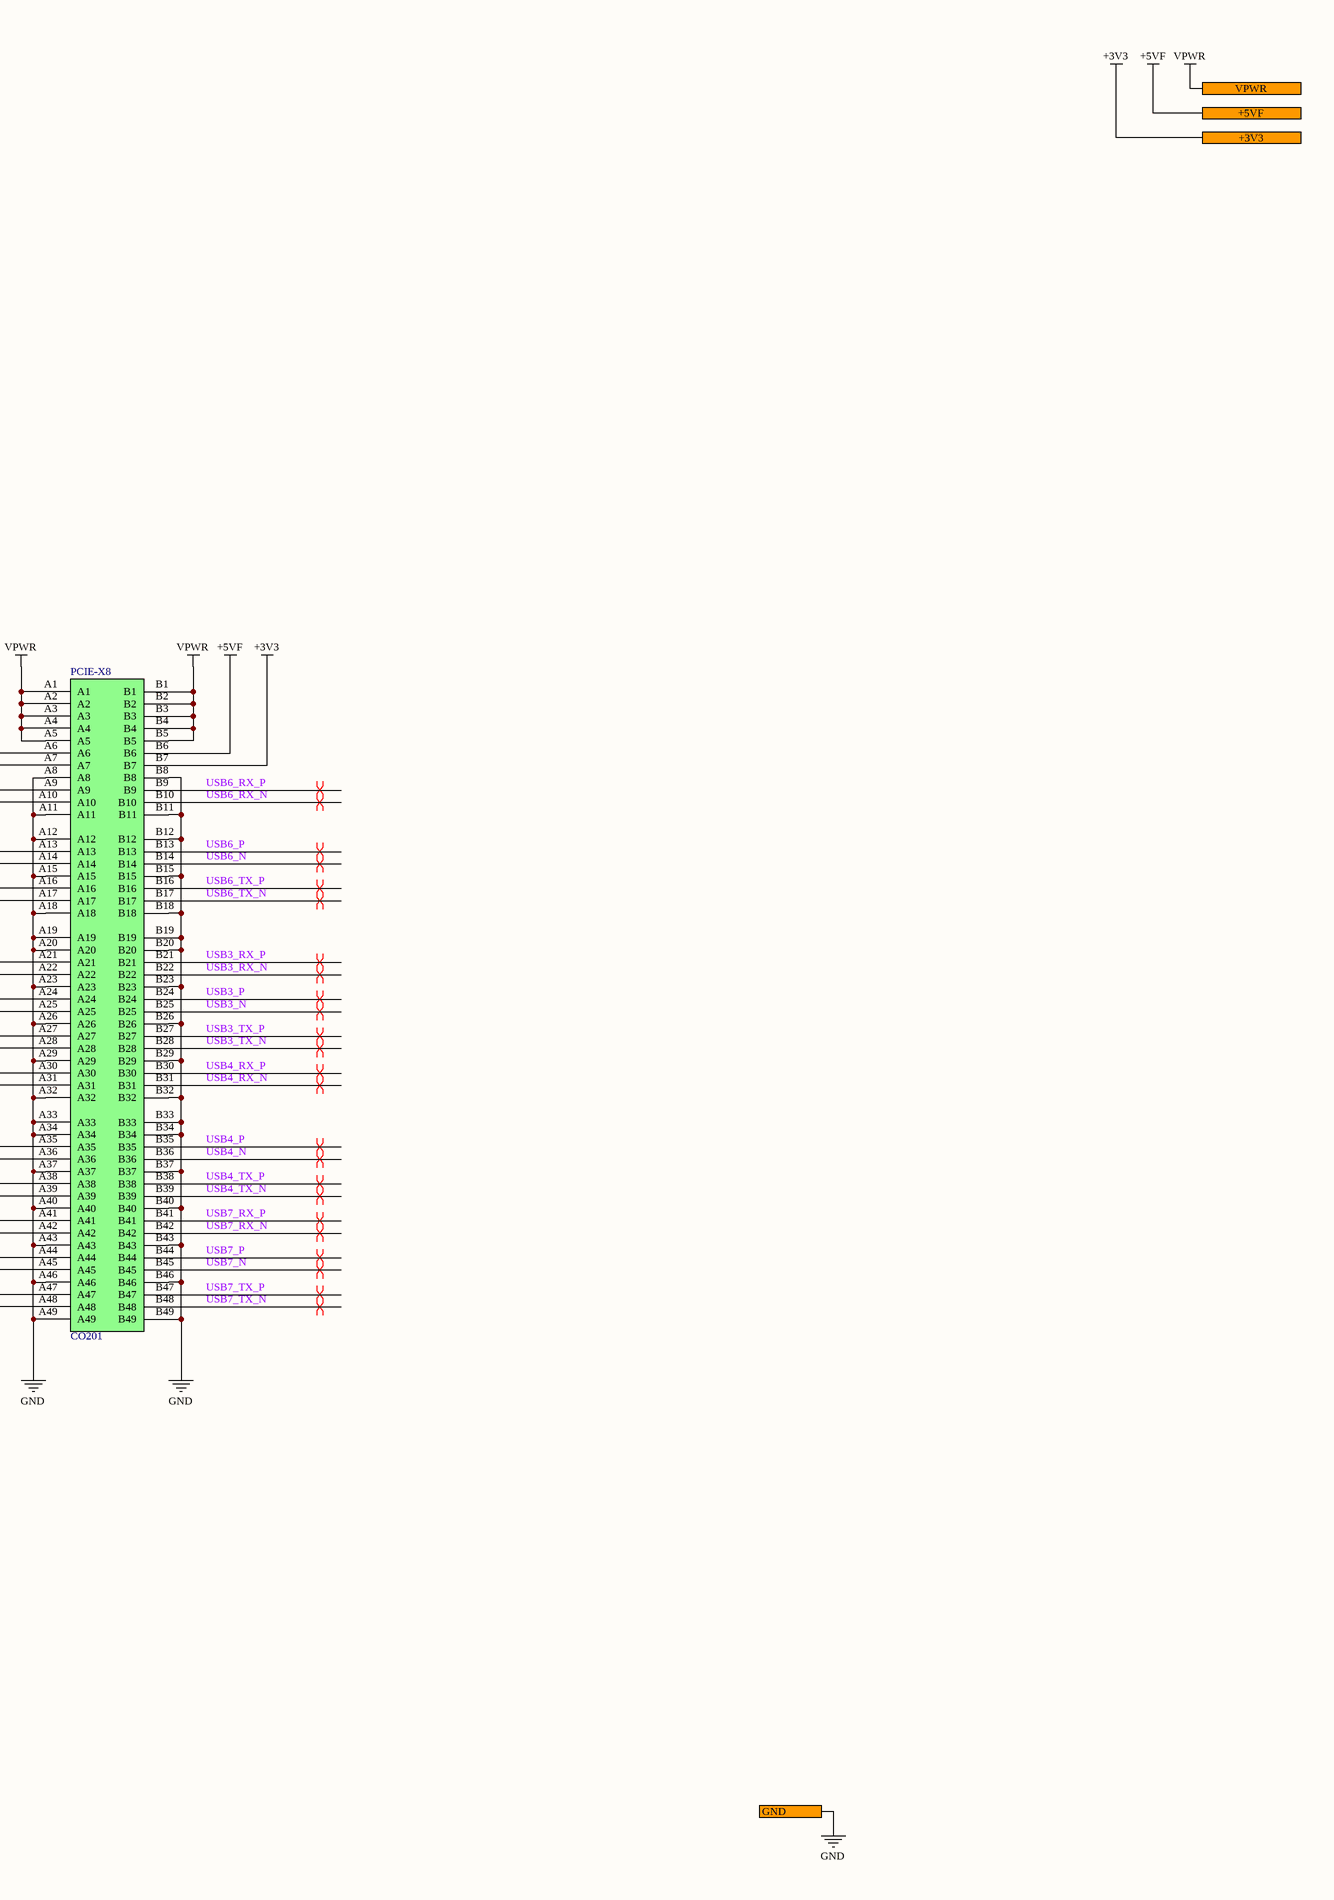
[diagram p5: 201_ConnectionPart1-Part2.SchDoc, right]

### Parts
CO201  PCIE-X8  [1-2362375-3]

### Ports
+3V3, +5VF, GND, USB0 (harness HU0), USB1 (harness HU1), USB2 (harness HU2), USB3 (harness HU3), USB4 (harness HU4), USB5 (harness HU5), USB6 (harness HU6), USB7 (harness HU7), VPWR

### Harnesses
HU0: USB0_5V, USB0_TX_P, USB0_TX_N, USB0_N, USB0_RX_P, USB0_RX_N, USB0_SEL, USB0_P, USB0_CC, USB0_SBU
HU5: USB5_5V, USB5_TX_P, USB5_TX_N, USB5_N, USB5_RX_P, USB5_RX_N, USB5_SEL, USB5_P, USB5_CC, USB5_SBU
HU4: USB4_5V, USB4_TX_P, USB4_TX_N, USB4_N, USB4_RX_P, USB4_RX_N, USB4_SEL, USB4_P, USB4_CC, USB4_SBU
HU1: USB1_5V, USB1_TX_P, USB1_TX_N, USB1_N, USB1_RX_P, USB1_RX_N, USB1_SEL, USB1_P, USB1_CC, USB1_SBU
HU7: USB7_5V, USB7_TX_P, USB7_TX_N, USB7_N, USB7_RX_P, USB7_RX_N, USB7_SEL, USB7_P, USB7_CC, USB7_SBU
HU6: USB6_5V, USB6_TX_P, USB6_TX_N, USB6_N, USB6_RX_P, USB6_RX_N, USB6_SEL, USB6_P, USB6_CC, USB6_SBU
HU3: USB3_5V, USB3_TX_P, USB3_TX_N, USB3_N, USB3_RX_P, USB3_RX_N, USB3_SEL, USB3_P, USB3_CC, USB3_SBU
HU2: USB2_5V, USB2_TX_P, USB2_TX_N, USB2_N, USB2_RX_P, USB2_RX_N, USB2_SEL, USB2_P, USB2_CC, USB2_SBU

### Nets
+3V3: CO201.A7 CO201.B7 ; port +3V3
+5VF: CO201.A6 CO201.B6 ; port +5VF
GND: CO201.A8 CO201.A11 CO201.A12 CO201.A15 CO201.A18 CO201.A19 CO201.A20 CO201.A23 CO201.A26 CO201.A29 CO201.A32 CO201.A33 CO201.A34 CO201.A37 CO201.A40 CO201.A43 CO201.A46 CO201.A49 CO201.B8 CO201.B11 CO201.B12 CO201.B15 CO201.B18 CO201.B19 CO201.B20 CO201.B23 CO201.B26 CO201.B29 CO201.B32 CO201.B33 CO201.B34 CO201.B37 CO201.B40 CO201.B43 CO201.B46 CO201.B49 ; port GND
VPWR: CO201.A1 CO201.A2 CO201.A3 CO201.A4 CO201.A5 CO201.B1 CO201.B2 CO201.B3 CO201.B4 CO201.B5 ; port VPWR
USB0_N: CO201.A13 ; port USB0.USB0_N
USB0_P: CO201.A14 ; port USB0.USB0_P
USB0_RX_N: CO201.A16 ; port USB0.USB0_RX_N
USB0_RX_P: CO201.A17 ; port USB0.USB0_RX_P
USB0_TX_N: CO201.A9 ; port USB0.USB0_TX_N
USB0_TX_P: CO201.A10 ; port USB0.USB0_TX_P
USB1_N: CO201.A24 ; port USB1.USB1_N
USB1_P: CO201.A25 ; port USB1.USB1_P
USB1_RX_N: CO201.A27 ; port USB1.USB1_RX_N
USB1_RX_P: CO201.A28 ; port USB1.USB1_RX_P
USB1_TX_N: CO201.A21 ; port USB1.USB1_TX_N
USB1_TX_P: CO201.A22 ; port USB1.USB1_TX_P
USB2_N: CO201.A44 ; port USB2.USB2_N
USB2_P: CO201.A45 ; port USB2.USB2_P
USB2_RX_N: CO201.A47 ; port USB2.USB2_RX_N
USB2_RX_P: CO201.A48 ; port USB2.USB2_RX_P
USB2_TX_N: CO201.A41 ; port USB2.USB2_TX_N
USB2_TX_P: CO201.A42 ; port USB2.USB2_TX_P
USB3_N: CO201.B25 ; port USB3.USB3_N
USB3_P: CO201.B24 ; port USB3.USB3_P
USB3_RX_N: CO201.B22 ; port USB3.USB3_RX_N
USB3_RX_P: CO201.B21 ; port USB3.USB3_RX_P
USB3_TX_N: CO201.B28 ; port USB3.USB3_TX_N
USB3_TX_P: CO201.B27 ; port USB3.USB3_TX_P
USB4_N: CO201.B36 ; port USB4.USB4_N
USB4_P: CO201.B35 ; port USB4.USB4_P
USB4_RX_N: CO201.B31 ; port USB4.USB4_RX_N
USB4_RX_P: CO201.B30 ; port USB4.USB4_RX_P
USB4_TX_N: CO201.B39 ; port USB4.USB4_TX_N
USB4_TX_P: CO201.B38 ; port USB4.USB4_TX_P
USB5_N: CO201.A35 ; port USB5.USB5_N
USB5_P: CO201.A36 ; port USB5.USB5_P
USB5_RX_N: CO201.A38 ; port USB5.USB5_RX_N
USB5_RX_P: CO201.A39 ; port USB5.USB5_RX_P
USB5_TX_N: CO201.A30 ; port USB5.USB5_TX_N
USB5_TX_P: CO201.A31 ; port USB5.USB5_TX_P
USB6_N: CO201.B14 ; port USB6.USB6_N
USB6_P: CO201.B13 ; port USB6.USB6_P
USB6_RX_N: CO201.B10 ; port USB6.USB6_RX_N
USB6_RX_P: CO201.B9 ; port USB6.USB6_RX_P
USB6_TX_N: CO201.B17 ; port USB6.USB6_TX_N
USB6_TX_P: CO201.B16 ; port USB6.USB6_TX_P
USB7_N: CO201.B45 ; port USB7.USB7_N
USB7_P: CO201.B44 ; port USB7.USB7_P
USB7_RX_N: CO201.B42 ; port USB7.USB7_RX_N
USB7_RX_P: CO201.B41 ; port USB7.USB7_RX_P
USB7_TX_N: CO201.B48 ; port USB7.USB7_TX_N
USB7_TX_P: CO201.B47 ; port USB7.USB7_TX_P

### Layout directives
differential pair; differential pair class USB3: USB0_N, USB0_P, USB0_RX_N, USB0_RX_P, USB0_TX_N, USB0_TX_P, USB1_N, USB1_P, USB1_RX_N, USB1_RX_P, USB1_TX_N, USB1_TX_P, USB2_N, USB2_P, USB2_RX_N, USB2_RX_P, USB2_TX_N, USB2_TX_P, USB3_N, USB3_P, USB3_RX_N, USB3_RX_P, USB3_TX_N, USB3_TX_P, USB4_N, USB4_P, USB4_RX_N, USB4_RX_P, USB4_TX_N, USB4_TX_P, USB5_N, USB5_P, USB5_RX_N, USB5_RX_P, USB5_TX_N, USB5_TX_P, USB6_N, USB6_P, USB6_RX_N, USB6_RX_P, USB6_TX_N, USB6_TX_P, USB7_N, USB7_P, USB7_RX_N, USB7_RX_P, USB7_TX_N, USB7_TX_P

### Notes on the sheet
- Title
- Size:
- Date:
- File:
- A2
- Number:
- Time:
- Revision:
- Sheet
- of

### Library data of the parts
CO201 = CO0048: PCIE GEN4-X8, Female, Board guide, Locking ramp; Part Number: CO0048; ID: 48; RefVal: PCIE-X8; ManfactPart: 1-2362375-3

## Sheet 301_PowerGridUSB.SchDoc: Power to USB Connectors Grid
size A2; Organization: Greenfield Tech Solutions; Address1: Molendreef 33; Address2: Ossendrecht; Address3: 4641CS; Address4: The Netherlands; DocumentNumber: P234; Revision: 0.6; SheetNumber: 4; SheetTotal: 4
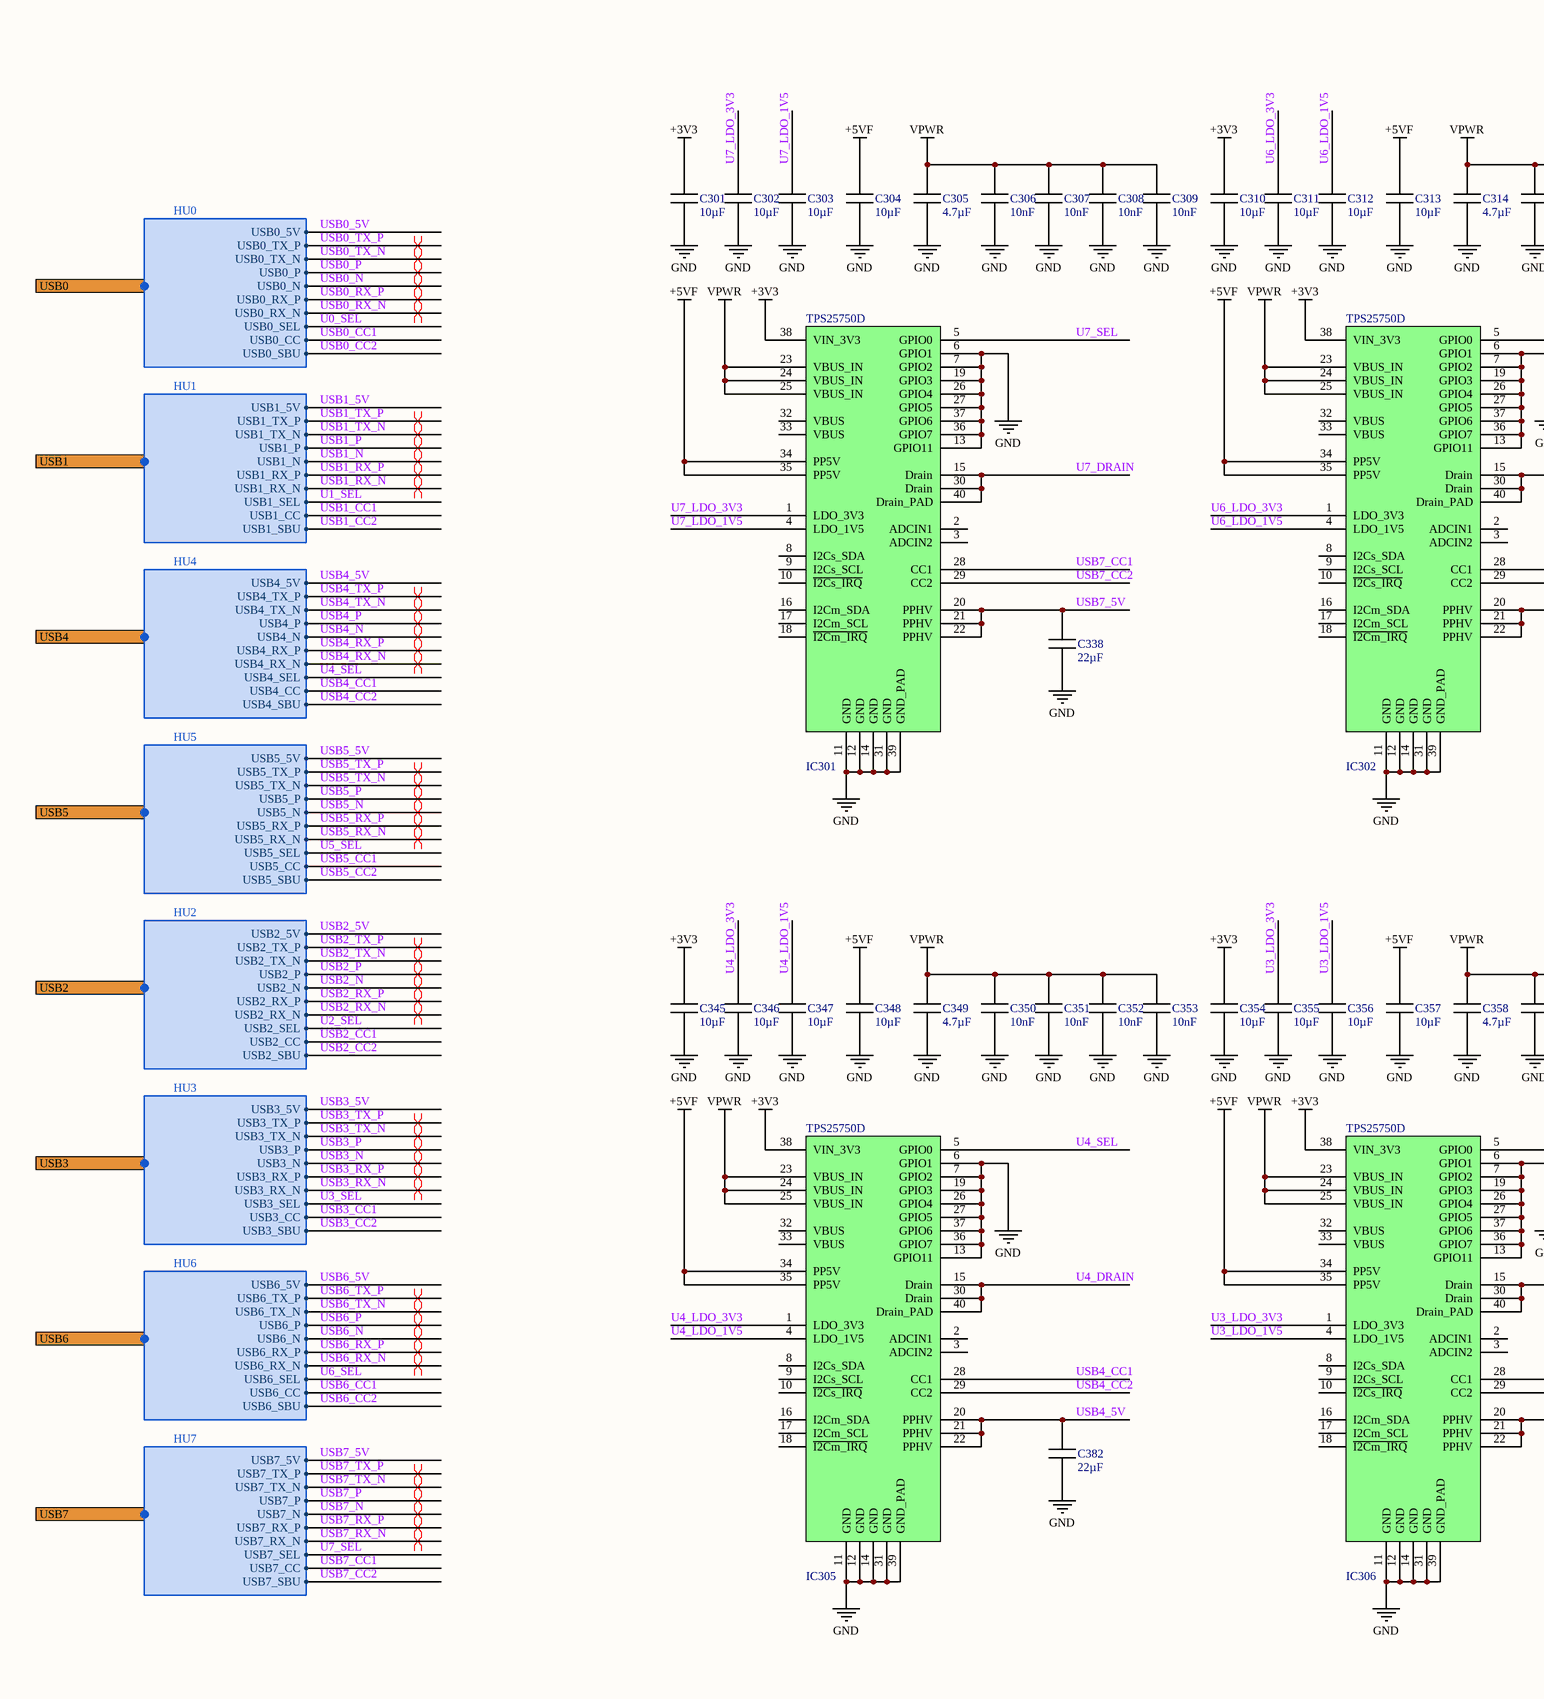
[diagram p6: 301_PowerGridUSB.SchDoc, left]
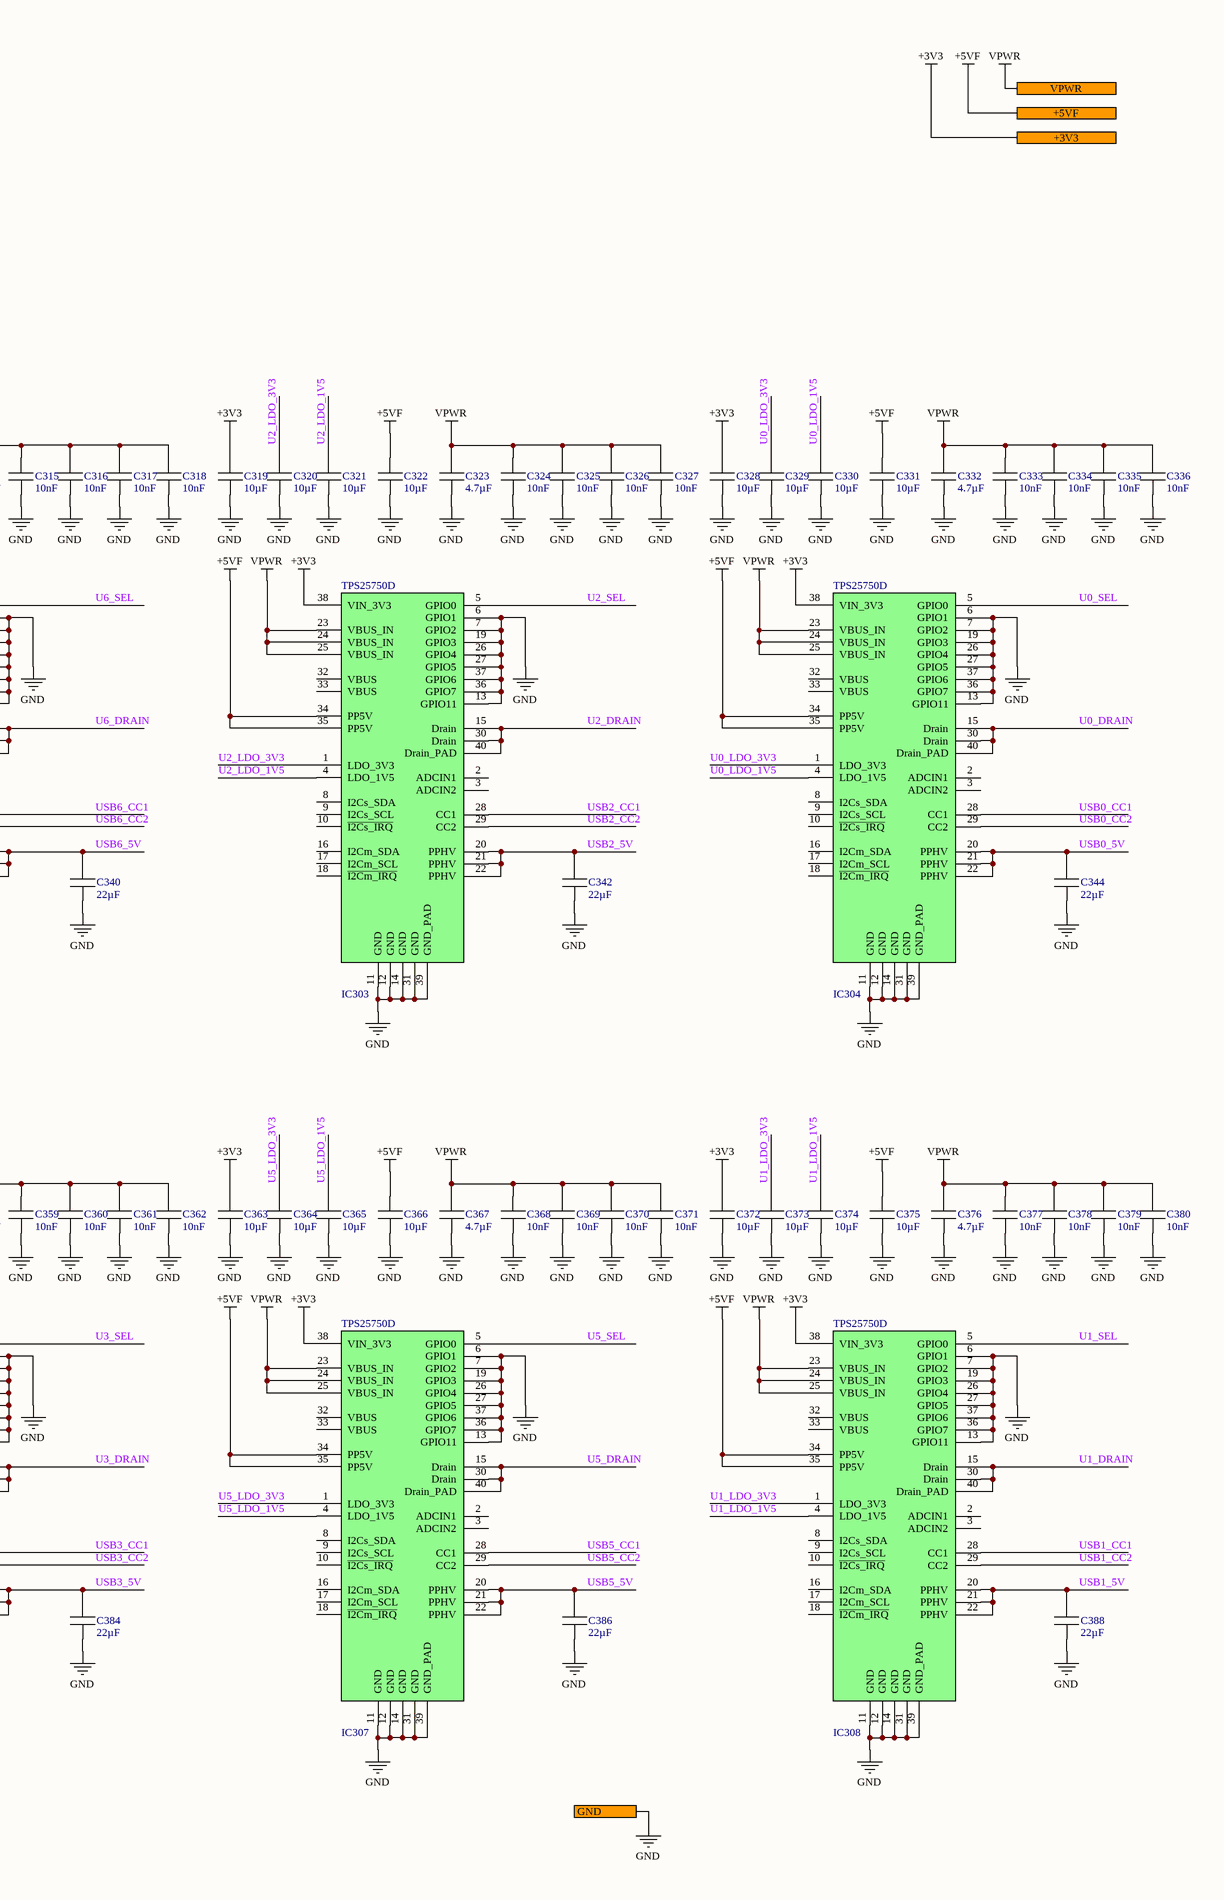
[diagram p7: 301_PowerGridUSB.SchDoc, right]

### Parts
C301  10µF  [C0805]
C302  10µF  [C0805]
C303  10µF  [C0805]
C304  10µF  [C0805]
C305  4.7µF  [C1210]
C306  10nF  [C0805]
C307  10nF  [C0805]
C308  10nF  [C0805]
C309  10nF  [C0805]
C310  10µF  [C0805]
C311  10µF  [C0805]
C312  10µF  [C0805]
C313  10µF  [C0805]
C314  4.7µF  [C1210]
C315  10nF  [C0805]
C316  10nF  [C0805]
C317  10nF  [C0805]
C318  10nF  [C0805]
C319  10µF  [C0805]
C320  10µF  [C0805]
C321  10µF  [C0805]
C322  10µF  [C0805]
C323  4.7µF  [C1210]
C324  10nF  [C0805]
C325  10nF  [C0805]
C326  10nF  [C0805]
C327  10nF  [C0805]
C328  10µF  [C0805]
C329  10µF  [C0805]
C330  10µF  [C0805]
C331  10µF  [C0805]
C332  4.7µF  [C1210]
C333  10nF  [C0805]
C334  10nF  [C0805]
C335  10nF  [C0805]
C336  10nF  [C0805]
C338  22µF  [C2220]
C340  22µF  [C2220]
C342  22µF  [C2220]
C344  22µF  [C2220]
C345  10µF  [C0805]
C346  10µF  [C0805]
C347  10µF  [C0805]
C348  10µF  [C0805]
C349  4.7µF  [C1210]
C350  10nF  [C0805]
C351  10nF  [C0805]
C352  10nF  [C0805]
C353  10nF  [C0805]
C354  10µF  [C0805]
C355  10µF  [C0805]
C356  10µF  [C0805]
C357  10µF  [C0805]
C358  4.7µF  [C1210]
C359  10nF  [C0805]
C360  10nF  [C0805]
C361  10nF  [C0805]
C362  10nF  [C0805]
C363  10µF  [C0805]
C364  10µF  [C0805]
C365  10µF  [C0805]
C366  10µF  [C0805]
C367  4.7µF  [C1210]
C368  10nF  [C0805]
C369  10nF  [C0805]
C370  10nF  [C0805]
C371  10nF  [C0805]
C372  10µF  [C0805]
C373  10µF  [C0805]
C374  10µF  [C0805]
C375  10µF  [C0805]
C376  4.7µF  [C1210]
C377  10nF  [C0805]
C378  10nF  [C0805]
C379  10nF  [C0805]
C380  10nF  [C0805]
C382  22µF  [C2220]
C384  22µF  [C2220]
C386  22µF  [C2220]
C388  22µF  [C2220]
IC301  TPS25750D  [QFNRJK-38]
IC302  TPS25750D  [QFNRJK-38]
IC303  TPS25750D  [QFNRJK-38]
IC304  TPS25750D  [QFNRJK-38]
IC305  TPS25750D  [QFNRJK-38]
IC306  TPS25750D  [QFNRJK-38]
IC307  TPS25750D  [QFNRJK-38]
IC308  TPS25750D  [QFNRJK-38]

### Ports
+3V3, +5VF, GND, USB0 (harness HU0), USB1 (harness HU1), USB2 (harness HU2), USB3 (harness HU3), USB4 (harness HU4), USB5 (harness HU5), USB6 (harness HU6), USB7 (harness HU7), VPWR

### Harnesses
HU0: USB0_5V, USB0_TX_P, USB0_TX_N, USB0_N, USB0_RX_P, USB0_RX_N, USB0_SEL, USB0_P, USB0_CC, USB0_SBU
HU5: USB5_5V, USB5_TX_P, USB5_TX_N, USB5_N, USB5_RX_P, USB5_RX_N, USB5_SEL, USB5_P, USB5_CC, USB5_SBU
HU4: USB4_5V, USB4_TX_P, USB4_TX_N, USB4_N, USB4_RX_P, USB4_RX_N, USB4_SEL, USB4_P, USB4_CC, USB4_SBU
HU1: USB1_5V, USB1_TX_P, USB1_TX_N, USB1_N, USB1_RX_P, USB1_RX_N, USB1_SEL, USB1_P, USB1_CC, USB1_SBU
HU7: USB7_5V, USB7_TX_P, USB7_TX_N, USB7_N, USB7_RX_P, USB7_RX_N, USB7_SEL, USB7_P, USB7_CC, USB7_SBU
HU6: USB6_5V, USB6_TX_P, USB6_TX_N, USB6_N, USB6_RX_P, USB6_RX_N, USB6_SEL, USB6_P, USB6_CC, USB6_SBU
HU3: USB3_5V, USB3_TX_P, USB3_TX_N, USB3_N, USB3_RX_P, USB3_RX_N, USB3_SEL, USB3_P, USB3_CC, USB3_SBU
HU2: USB2_5V, USB2_TX_P, USB2_TX_N, USB2_N, USB2_RX_P, USB2_RX_N, USB2_SEL, USB2_P, USB2_CC, USB2_SBU

### Nets
+3V3: C301.1 C310.1 C319.1 C328.1 C345.1 C354.1 C363.1 C372.1 IC301.38(VIN_3V3) IC302.38(VIN_3V3) IC303.38(VIN_3V3) IC304.38(VIN_3V3) IC305.38(VIN_3V3) IC306.38(VIN_3V3) IC307.38(VIN_3V3) IC308.38(VIN_3V3) ; port +3V3
+5VF: C304.1 C313.1 C322.1 C331.1 C348.1 C357.1 C366.1 C375.1 IC301.34(PP5V) IC301.35(PP5V) IC302.34(PP5V) IC302.35(PP5V) IC303.34(PP5V) IC303.35(PP5V) IC304.34(PP5V) IC304.35(PP5V) IC305.34(PP5V) IC305.35(PP5V) IC306.34(PP5V) IC306.35(PP5V) IC307.34(PP5V) IC307.35(PP5V) IC308.34(PP5V) IC308.35(PP5V) ; port +5VF
GND: C301.2 C302.2 C303.2 C304.2 C305.2 C306.2 C307.2 C308.2 C309.2 C310.2 C311.2 C312.2 C313.2 C314.2 C315.2 C316.2 C317.2 C318.2 C319.2 C320.2 C321.2 C322.2 C323.2 C324.2 C325.2 C326.2 C327.2 C328.2 C329.2 C330.2 C331.2 C332.2 C333.2 C334.2 C335.2 C336.2 C338.2 C340.2 C342.2 C344.2 C345.2 C346.2 C347.2 C348.2 C349.2 C350.2 C351.2 C352.2 C353.2 C354.2 C355.2 C356.2 C357.2 C358.2 C359.2 C360.2 C361.2 C362.2 C363.2 C364.2 C365.2 C366.2 C367.2 C368.2 C369.2 C370.2 C371.2 C372.2 C373.2 C374.2 C375.2 C376.2 C377.2 C378.2 C379.2 C380.2 C382.2 C384.2 C386.2 C388.2 IC301.6(GPIO1) IC301.7(GPIO2) IC301.11(GND) IC301.12(GND) IC301.13(GPIO11) IC301.14(GND) IC301.19(GPIO3) IC301.26(GPIO4) IC301.27(GPIO5) IC301.31(GND) IC301.36(GPIO7) IC301.37(GPIO6) IC301.39(GND_PAD) IC302.6(GPIO1) IC302.7(GPIO2) IC302.11(GND) IC302.12(GND) IC302.13(GPIO11) IC302.14(GND) IC302.19(GPIO3) IC302.26(GPIO4) IC302.27(GPIO5) IC302.31(GND) IC302.36(GPIO7) IC302.37(GPIO6) IC302.39(GND_PAD) IC303.6(GPIO1) IC303.7(GPIO2) IC303.11(GND) IC303.12(GND) IC303.13(GPIO11) IC303.14(GND) IC303.19(GPIO3) IC303.26(GPIO4) IC303.27(GPIO5) IC303.31(GND) IC303.36(GPIO7) IC303.37(GPIO6) IC303.39(GND_PAD) IC304.6(GPIO1) IC304.7(GPIO2) IC304.11(GND) IC304.12(GND) IC304.13(GPIO11) IC304.14(GND) IC304.19(GPIO3) IC304.26(GPIO4) IC304.27(GPIO5) IC304.31(GND) IC304.36(GPIO7) IC304.37(GPIO6) IC304.39(GND_PAD) IC305.6(GPIO1) IC305.7(GPIO2) IC305.11(GND) IC305.12(GND) IC305.13(GPIO11) IC305.14(GND) IC305.19(GPIO3) IC305.26(GPIO4) IC305.27(GPIO5) IC305.31(GND) IC305.36(GPIO7) IC305.37(GPIO6) IC305.39(GND_PAD) IC306.6(GPIO1) IC306.7(GPIO2) IC306.11(GND) IC306.12(GND) IC306.13(GPIO11) IC306.14(GND) IC306.19(GPIO3) IC306.26(GPIO4) IC306.27(GPIO5) IC306.31(GND) IC306.36(GPIO7) IC306.37(GPIO6) IC306.39(GND_PAD) IC307.6(GPIO1) IC307.7(GPIO2) IC307.11(GND) IC307.12(GND) IC307.13(GPIO11) IC307.14(GND) IC307.19(GPIO3) IC307.26(GPIO4) IC307.27(GPIO5) IC307.31(GND) IC307.36(GPIO7) IC307.37(GPIO6) IC307.39(GND_PAD) IC308.6(GPIO1) IC308.7(GPIO2) IC308.11(GND) IC308.12(GND) IC308.13(GPIO11) IC308.14(GND) IC308.19(GPIO3) IC308.26(GPIO4) IC308.27(GPIO5) IC308.31(GND) IC308.36(GPIO7) IC308.37(GPIO6) IC308.39(GND_PAD) ; port GND
VPWR: C305.1 C306.1 C307.1 C308.1 C309.1 C314.1 C315.1 C316.1 C317.1 C318.1 C323.1 C324.1 C325.1 C326.1 C327.1 C332.1 C333.1 C334.1 C335.1 C336.1 C349.1 C350.1 C351.1 C352.1 C353.1 C358.1 C359.1 C360.1 C361.1 C362.1 C367.1 C368.1 C369.1 C370.1 C371.1 C376.1 C377.1 C378.1 C379.1 C380.1 IC301.23(VBUS_IN) IC301.24(VBUS_IN) IC301.25(VBUS_IN) IC302.23(VBUS_IN) IC302.24(VBUS_IN) IC302.25(VBUS_IN) IC303.23(VBUS_IN) IC303.24(VBUS_IN) IC303.25(VBUS_IN) IC304.23(VBUS_IN) IC304.24(VBUS_IN) IC304.25(VBUS_IN) IC305.23(VBUS_IN) IC305.24(VBUS_IN) IC305.25(VBUS_IN) IC306.23(VBUS_IN) IC306.24(VBUS_IN) IC306.25(VBUS_IN) IC307.23(VBUS_IN) IC307.24(VBUS_IN) IC307.25(VBUS_IN) IC308.23(VBUS_IN) IC308.24(VBUS_IN) IC308.25(VBUS_IN) ; port VPWR
U0_DRAIN: IC304.15(Drain) IC304.30(Drain) IC304.40(Drain_PAD)
U0_LDO_1V5: C330.1 IC304.4(LDO_1V5)
U0_LDO_3V3: C329.1 IC304.1(LDO_3V3)
U0_SEL: IC304.5(GPIO0) ; port USB0.USB0_SEL
U1_DRAIN: IC308.15(Drain) IC308.30(Drain) IC308.40(Drain_PAD)
U1_LDO_1V5: C374.1 IC308.4(LDO_1V5)
U1_LDO_3V3: C373.1 IC308.1(LDO_3V3)
U1_SEL: IC308.5(GPIO0) ; port USB1.USB1_SEL
U2_DRAIN: IC303.15(Drain) IC303.30(Drain) IC303.40(Drain_PAD)
U2_LDO_1V5: C321.1 IC303.4(LDO_1V5)
U2_LDO_3V3: C320.1 IC303.1(LDO_3V3)
U2_SEL: IC303.5(GPIO0) ; port USB2.USB2_SEL
U3_DRAIN: IC306.15(Drain) IC306.30(Drain) IC306.40(Drain_PAD)
U3_LDO_1V5: C356.1 IC306.4(LDO_1V5)
U3_LDO_3V3: C355.1 IC306.1(LDO_3V3)
U3_SEL: IC306.5(GPIO0) ; port USB3.USB3_SEL
U4_DRAIN: IC305.15(Drain) IC305.30(Drain) IC305.40(Drain_PAD)
U4_LDO_1V5: C347.1 IC305.4(LDO_1V5)
U4_LDO_3V3: C346.1 IC305.1(LDO_3V3)
U4_SEL: IC305.5(GPIO0) ; port USB4.USB4_SEL
U5_DRAIN: IC307.15(Drain) IC307.30(Drain) IC307.40(Drain_PAD)
U5_LDO_1V5: C365.1 IC307.4(LDO_1V5)
U5_LDO_3V3: C364.1 IC307.1(LDO_3V3)
U5_SEL: IC307.5(GPIO0) ; port USB5.USB5_SEL
U6_DRAIN: IC302.15(Drain) IC302.30(Drain) IC302.40(Drain_PAD)
U6_LDO_1V5: C312.1 IC302.4(LDO_1V5)
U6_LDO_3V3: C311.1 IC302.1(LDO_3V3)
U6_SEL: IC302.5(GPIO0) ; port USB6.USB6_SEL
U7_DRAIN: IC301.15(Drain) IC301.30(Drain) IC301.40(Drain_PAD)
U7_LDO_1V5: C303.1 IC301.4(LDO_1V5)
U7_LDO_3V3: C302.1 IC301.1(LDO_3V3)
U7_SEL: IC301.5(GPIO0) ; port USB7.USB7_SEL
USB0_5V: C344.1 IC304.20(PPHV) IC304.21(PPHV) IC304.22(PPHV) ; port USB0.USB0_5V
USB0_CC1: IC304.28(CC1) ; port USB0.USB0_CC
USB0_CC2: IC304.29(CC2) ; port USB0.USB0_SBU
USB1_5V: C388.1 IC308.20(PPHV) IC308.21(PPHV) IC308.22(PPHV) ; port USB1.USB1_5V
USB1_CC1: IC308.28(CC1) ; port USB1.USB1_CC
USB1_CC2: IC308.29(CC2) ; port USB1.USB1_SBU
USB2_5V: C342.1 IC303.20(PPHV) IC303.21(PPHV) IC303.22(PPHV) ; port USB2.USB2_5V
USB2_CC1: IC303.28(CC1) ; port USB2.USB2_CC
USB2_CC2: IC303.29(CC2) ; port USB2.USB2_SBU
USB3_5V: C384.1 IC306.20(PPHV) IC306.21(PPHV) IC306.22(PPHV) ; port USB3.USB3_5V
USB3_CC1: IC306.28(CC1) ; port USB3.USB3_CC
USB3_CC2: IC306.29(CC2) ; port USB3.USB3_SBU
USB4_5V: C382.1 IC305.20(PPHV) IC305.21(PPHV) IC305.22(PPHV) ; port USB4.USB4_5V
USB4_CC1: IC305.28(CC1) ; port USB4.USB4_CC
USB4_CC2: IC305.29(CC2) ; port USB4.USB4_SBU
USB5_5V: C386.1 IC307.20(PPHV) IC307.21(PPHV) IC307.22(PPHV) ; port USB5.USB5_5V
USB5_CC1: IC307.28(CC1) ; port USB5.USB5_CC
USB5_CC2: IC307.29(CC2) ; port USB5.USB5_SBU
USB6_5V: C340.1 IC302.20(PPHV) IC302.21(PPHV) IC302.22(PPHV) ; port USB6.USB6_5V
USB6_CC1: IC302.28(CC1) ; port USB6.USB6_CC
USB6_CC2: IC302.29(CC2) ; port USB6.USB6_SBU
USB7_5V: C338.1 IC301.20(PPHV) IC301.21(PPHV) IC301.22(PPHV) ; port USB7.USB7_5V
USB7_CC1: IC301.28(CC1) ; port USB7.USB7_CC
USB7_CC2: IC301.29(CC2) ; port USB7.USB7_SBU

Not connected (* = marked no-connect by the designer): IC301 2(ADCIN1) 3(ADCIN2) 8(I2Cs_SDA) 9(I2Cs_SCL) 10(~{I2Cs_IRQ}) 16(I2Cm_SDA) 17(I2Cm_SCL) 18(~{I2Cm_IRQ}) 32(VBUS) 33(VBUS); IC302 2(ADCIN1) 3(ADCIN2) 8(I2Cs_SDA) 9(I2Cs_SCL) 10(~{I2Cs_IRQ}) 16(I2Cm_SDA) 17(I2Cm_SCL) 18(~{I2Cm_IRQ}) 32(VBUS) 33(VBUS); IC303 2(ADCIN1) 3(ADCIN2) 8(I2Cs_SDA) 9(I2Cs_SCL) 10(~{I2Cs_IRQ}) 16(I2Cm_SDA) 17(I2Cm_SCL) 18(~{I2Cm_IRQ}) 32(VBUS) 33(VBUS); IC304 2(ADCIN1) 3(ADCIN2) 8(I2Cs_SDA) 9(I2Cs_SCL) 10(~{I2Cs_IRQ}) 16(I2Cm_SDA) 17(I2Cm_SCL) 18(~{I2Cm_IRQ}) 32(VBUS) 33(VBUS); IC305 2(ADCIN1) 3(ADCIN2) 8(I2Cs_SDA) 9(I2Cs_SCL) 10(~{I2Cs_IRQ}) 16(I2Cm_SDA) 17(I2Cm_SCL) 18(~{I2Cm_IRQ}) 32(VBUS) 33(VBUS); IC306 2(ADCIN1) 3(ADCIN2) 8(I2Cs_SDA) 9(I2Cs_SCL) 10(~{I2Cs_IRQ}) 16(I2Cm_SDA) 17(I2Cm_SCL) 18(~{I2Cm_IRQ}) 32(VBUS) 33(VBUS); IC307 2(ADCIN1) 3(ADCIN2) 8(I2Cs_SDA) 9(I2Cs_SCL) 10(~{I2Cs_IRQ}) 16(I2Cm_SDA) 17(I2Cm_SCL) 18(~{I2Cm_IRQ}) 32(VBUS) 33(VBUS); IC308 2(ADCIN1) 3(ADCIN2) 8(I2Cs_SDA) 9(I2Cs_SCL) 10(~{I2Cs_IRQ}) 16(I2Cm_SDA) 17(I2Cm_SCL) 18(~{I2Cm_IRQ}) 32(VBUS) 33(VBUS)

### Layout directives
differential pair; differential pair class USB3: USB0_N, USB0_P, USB0_RX_N, USB0_RX_P, USB0_TX_N, USB0_TX_P, USB1_N, USB1_P, USB1_RX_N, USB1_RX_P, USB1_TX_N, USB1_TX_P, USB2_N, USB2_P, USB2_RX_N, USB2_RX_P, USB2_TX_N, USB2_TX_P, USB3_N, USB3_P, USB3_RX_N, USB3_RX_P, USB3_TX_N, USB3_TX_P, USB4_N, USB4_P, USB4_RX_N, USB4_RX_P, USB4_TX_N, USB4_TX_P, USB5_N, USB5_P, USB5_RX_N, USB5_RX_P, USB5_TX_N, USB5_TX_P, USB6_N, USB6_P, USB6_RX_N, USB6_RX_P, USB6_TX_N, USB6_TX_P, USB7_N, USB7_P, USB7_RX_N, USB7_RX_P, USB7_TX_N, USB7_TX_P

### Notes on the sheet
- Title
- Size:
- Date:
- File:
- A2
- Number:
- Time:
- Revision:
- Sheet
- of

### Library data of the parts
C301-C304 C310-C313 C319-C322 C328-C331 C345-C348 C354-C357 C363-C366 C372-C375 = CA0001: 10µF 16V 10% X5R; Part Number: CA0001; ManfactPart: GRM21BR61C106KE15L; ID: 1; RefVal: 10µF
C305 C314 C323 C332 C349 C358 C367 C376 = CA0038: 4.7µF 100V 10% X5R; Part Number: CA0038; ManfactPart: HMK325BJ475KM-PE; ID: 38; RefVal: 4.7µF
C306-C309 C315-C318 C324-C327 C333-C336 C350-C353 C359-C362 C368-C371 C377-C380 = CA0021: 10nF 50V 10% X7R; Part Number: CA0021; ManfactPart: C0805C103K5RAC; ID: 21; RefVal: 10nF
C338 C340 C342 C344 C382 C384 C386 C388 = CA0051: 22µF 63V 20% X7R; Part Number: CA0051; ManfactPart: KRM55WR71J226MH01K; ID: 51; RefVal: 22µF
IC301-IC308 = IC0041: USB Type-C and USB PD Controller with Integrated Power Switches Optimized for Power Applications; Part Number: IC0041; ID: 41; RefVal: TPS25750D; ManfactPart: TPS25750D

## Nets that join several sheets
+3V3: 201_ConnectionPart1-Part2 (CO201.A7 CO201.B7), 301_PowerGridUSB (16 pins)
+5VF: 201_ConnectionPart1-Part2 (CO201.A6 CO201.B6), 301_PowerGridUSB (24 pins)
GND: 001_top (6 pins), 101_GridPosMainHub (72 pins), 201_ConnectionPart1-Part2 (36 pins), 301_PowerGridUSB (184 pins)
VPWR: 201_ConnectionPart1-Part2 (10 pins), 301_PowerGridUSB (64 pins)
U0_SEL: 101_GridPosMainHub (IC101.16), 301_PowerGridUSB (IC304.5)
U1_SEL: 101_GridPosMainHub (IC103.16), 301_PowerGridUSB (IC308.5)
U2_SEL: 101_GridPosMainHub (IC105.16), 301_PowerGridUSB (IC303.5)
U3_SEL: 101_GridPosMainHub (IC107.16), 301_PowerGridUSB (IC306.5)
U4_SEL: 101_GridPosMainHub (IC102.16), 301_PowerGridUSB (IC305.5)
U5_SEL: 101_GridPosMainHub (IC104.16), 301_PowerGridUSB (IC307.5)
U6_SEL: 101_GridPosMainHub (IC106.16), 301_PowerGridUSB (IC302.5)
U7_SEL: 101_GridPosMainHub (IC108.16), 301_PowerGridUSB (IC301.5)
USB0_5V: 101_GridPosMainHub (CO101.4 CO101.9 CO101.24 CO101.29), 301_PowerGridUSB (C344.1 IC304.20 IC304.21 IC304.22)
USB0_CC1: 101_GridPosMainHub (CO101.5), 301_PowerGridUSB (IC304.28)
USB0_CC2: 101_GridPosMainHub (CO101.25), 301_PowerGridUSB (IC304.29)
USB0_N: 101_GridPosMainHub (CO101.7 CO101.27 D101.1), 201_ConnectionPart1-Part2 (CO201.A13)
USB0_P: 101_GridPosMainHub (CO101.6 CO101.26 D101.2), 201_ConnectionPart1-Part2 (CO201.A14)
USB0_RX_N: 101_GridPosMainHub (D109.2 D109.9 IC101.17), 201_ConnectionPart1-Part2 (CO201.A16)
USB0_RX_P: 101_GridPosMainHub (D109.1 D109.10 IC101.18), 201_ConnectionPart1-Part2 (CO201.A17)
USB0_TX_N: 101_GridPosMainHub (D109.5 D109.6 IC101.14), 201_ConnectionPart1-Part2 (CO201.A9)
USB0_TX_P: 101_GridPosMainHub (D109.4 D109.7 IC101.15), 201_ConnectionPart1-Part2 (CO201.A10)
USB1_5V: 101_GridPosMainHub (CO103.4 CO103.9 CO103.24 CO103.29), 301_PowerGridUSB (C388.1 IC308.20 IC308.21 IC308.22)
USB1_CC1: 101_GridPosMainHub (CO103.5), 301_PowerGridUSB (IC308.28)
USB1_CC2: 101_GridPosMainHub (CO103.25), 301_PowerGridUSB (IC308.29)
USB1_N: 101_GridPosMainHub (CO103.7 CO103.27 D102.1), 201_ConnectionPart1-Part2 (CO201.A24)
USB1_P: 101_GridPosMainHub (CO103.6 CO103.26 D102.2), 201_ConnectionPart1-Part2 (CO201.A25)
USB1_RX_N: 101_GridPosMainHub (D110.2 D110.9 IC103.17), 201_ConnectionPart1-Part2 (CO201.A27)
USB1_RX_P: 101_GridPosMainHub (D110.1 D110.10 IC103.18), 201_ConnectionPart1-Part2 (CO201.A28)
USB1_TX_N: 101_GridPosMainHub (D110.5 D110.6 IC103.14), 201_ConnectionPart1-Part2 (CO201.A21)
USB1_TX_P: 101_GridPosMainHub (D110.4 D110.7 IC103.15), 201_ConnectionPart1-Part2 (CO201.A22)
USB2_5V: 101_GridPosMainHub (CO105.4 CO105.9 CO105.24 CO105.29), 301_PowerGridUSB (C342.1 IC303.20 IC303.21 IC303.22)
USB2_CC1: 101_GridPosMainHub (CO105.5), 301_PowerGridUSB (IC303.28)
USB2_CC2: 101_GridPosMainHub (CO105.25), 301_PowerGridUSB (IC303.29)
USB2_N: 101_GridPosMainHub (CO105.7 CO105.27 D103.1), 201_ConnectionPart1-Part2 (CO201.A44)
USB2_P: 101_GridPosMainHub (CO105.6 CO105.26 D103.2), 201_ConnectionPart1-Part2 (CO201.A45)
USB2_RX_N: 101_GridPosMainHub (D111.2 D111.9 IC105.17), 201_ConnectionPart1-Part2 (CO201.A47)
USB2_RX_P: 101_GridPosMainHub (D111.1 D111.10 IC105.18), 201_ConnectionPart1-Part2 (CO201.A48)
USB2_TX_N: 101_GridPosMainHub (D111.5 D111.6 IC105.14), 201_ConnectionPart1-Part2 (CO201.A41)
USB2_TX_P: 101_GridPosMainHub (D111.4 D111.7 IC105.15), 201_ConnectionPart1-Part2 (CO201.A42)
USB3_5V: 101_GridPosMainHub (CO107.4 CO107.9 CO107.24 CO107.29), 301_PowerGridUSB (C384.1 IC306.20 IC306.21 IC306.22)
USB3_CC1: 101_GridPosMainHub (CO107.5), 301_PowerGridUSB (IC306.28)
USB3_CC2: 101_GridPosMainHub (CO107.25), 301_PowerGridUSB (IC306.29)
USB3_N: 101_GridPosMainHub (CO107.7 CO107.27 D104.1), 201_ConnectionPart1-Part2 (CO201.B25)
USB3_P: 101_GridPosMainHub (CO107.6 CO107.26 D104.2), 201_ConnectionPart1-Part2 (CO201.B24)
USB3_RX_N: 101_GridPosMainHub (D112.2 D112.9 IC107.17), 201_ConnectionPart1-Part2 (CO201.B22)
USB3_RX_P: 101_GridPosMainHub (D112.1 D112.10 IC107.18), 201_ConnectionPart1-Part2 (CO201.B21)
USB3_TX_N: 101_GridPosMainHub (D112.5 D112.6 IC107.14), 201_ConnectionPart1-Part2 (CO201.B28)
USB3_TX_P: 101_GridPosMainHub (D112.4 D112.7 IC107.15), 201_ConnectionPart1-Part2 (CO201.B27)
USB4_5V: 101_GridPosMainHub (CO102.4 CO102.9 CO102.24 CO102.29), 301_PowerGridUSB (C382.1 IC305.20 IC305.21 IC305.22)
USB4_CC1: 101_GridPosMainHub (CO102.5), 301_PowerGridUSB (IC305.28)
USB4_CC2: 101_GridPosMainHub (CO102.25), 301_PowerGridUSB (IC305.29)
USB4_N: 101_GridPosMainHub (CO102.7 CO102.27 D105.1), 201_ConnectionPart1-Part2 (CO201.B36)
USB4_P: 101_GridPosMainHub (CO102.6 CO102.26 D105.2), 201_ConnectionPart1-Part2 (CO201.B35)
USB4_RX_N: 101_GridPosMainHub (D113.2 D113.9 IC102.17), 201_ConnectionPart1-Part2 (CO201.B31)
USB4_RX_P: 101_GridPosMainHub (D113.1 D113.10 IC102.18), 201_ConnectionPart1-Part2 (CO201.B30)
USB4_TX_N: 101_GridPosMainHub (D113.5 D113.6 IC102.14), 201_ConnectionPart1-Part2 (CO201.B39)
USB4_TX_P: 101_GridPosMainHub (D113.4 D113.7 IC102.15), 201_ConnectionPart1-Part2 (CO201.B38)
USB5_5V: 101_GridPosMainHub (CO104.4 CO104.9 CO104.24 CO104.29), 301_PowerGridUSB (C386.1 IC307.20 IC307.21 IC307.22)
USB5_CC1: 101_GridPosMainHub (CO104.5), 301_PowerGridUSB (IC307.28)
USB5_CC2: 101_GridPosMainHub (CO104.25), 301_PowerGridUSB (IC307.29)
USB5_N: 101_GridPosMainHub (CO104.7 CO104.27 D106.1), 201_ConnectionPart1-Part2 (CO201.A35)
USB5_P: 101_GridPosMainHub (CO104.6 CO104.26 D106.2), 201_ConnectionPart1-Part2 (CO201.A36)
USB5_RX_N: 101_GridPosMainHub (D114.2 D114.9 IC104.17), 201_ConnectionPart1-Part2 (CO201.A38)
USB5_RX_P: 101_GridPosMainHub (D114.1 D114.10 IC104.18), 201_ConnectionPart1-Part2 (CO201.A39)
USB5_TX_N: 101_GridPosMainHub (D114.5 D114.6 IC104.14), 201_ConnectionPart1-Part2 (CO201.A30)
USB5_TX_P: 101_GridPosMainHub (D114.4 D114.7 IC104.15), 201_ConnectionPart1-Part2 (CO201.A31)
USB6_5V: 101_GridPosMainHub (CO106.4 CO106.9 CO106.24 CO106.29), 301_PowerGridUSB (C340.1 IC302.20 IC302.21 IC302.22)
USB6_CC1: 101_GridPosMainHub (CO106.5), 301_PowerGridUSB (IC302.28)
USB6_CC2: 101_GridPosMainHub (CO106.25), 301_PowerGridUSB (IC302.29)
USB6_N: 101_GridPosMainHub (CO106.7 CO106.27 D107.1), 201_ConnectionPart1-Part2 (CO201.B14)
USB6_P: 101_GridPosMainHub (CO106.6 CO106.26 D107.2), 201_ConnectionPart1-Part2 (CO201.B13)
USB6_RX_N: 101_GridPosMainHub (D115.2 D115.9 IC106.17), 201_ConnectionPart1-Part2 (CO201.B10)
USB6_RX_P: 101_GridPosMainHub (D115.1 D115.10 IC106.18), 201_ConnectionPart1-Part2 (CO201.B9)
USB6_TX_N: 101_GridPosMainHub (D115.5 D115.6 IC106.14), 201_ConnectionPart1-Part2 (CO201.B17)
USB6_TX_P: 101_GridPosMainHub (D115.4 D115.7 IC106.15), 201_ConnectionPart1-Part2 (CO201.B16)
USB7_5V: 101_GridPosMainHub (CO108.4 CO108.9 CO108.24 CO108.29), 301_PowerGridUSB (C338.1 IC301.20 IC301.21 IC301.22)
USB7_CC1: 101_GridPosMainHub (CO108.5), 301_PowerGridUSB (IC301.28)
USB7_CC2: 101_GridPosMainHub (CO108.25), 301_PowerGridUSB (IC301.29)
USB7_N: 101_GridPosMainHub (CO108.7 CO108.27 D108.1), 201_ConnectionPart1-Part2 (CO201.B45)
USB7_P: 101_GridPosMainHub (CO108.6 CO108.26 D108.2), 201_ConnectionPart1-Part2 (CO201.B44)
USB7_RX_N: 101_GridPosMainHub (D116.2 D116.9 IC108.17), 201_ConnectionPart1-Part2 (CO201.B42)
USB7_RX_P: 101_GridPosMainHub (D116.1 D116.10 IC108.18), 201_ConnectionPart1-Part2 (CO201.B41)
USB7_TX_N: 101_GridPosMainHub (D116.5 D116.6 IC108.14), 201_ConnectionPart1-Part2 (CO201.B48)
USB7_TX_P: 101_GridPosMainHub (D116.4 D116.7 IC108.15), 201_ConnectionPart1-Part2 (CO201.B47)